# Altium project УШЯИ.467444.130_R1.PrjPcb
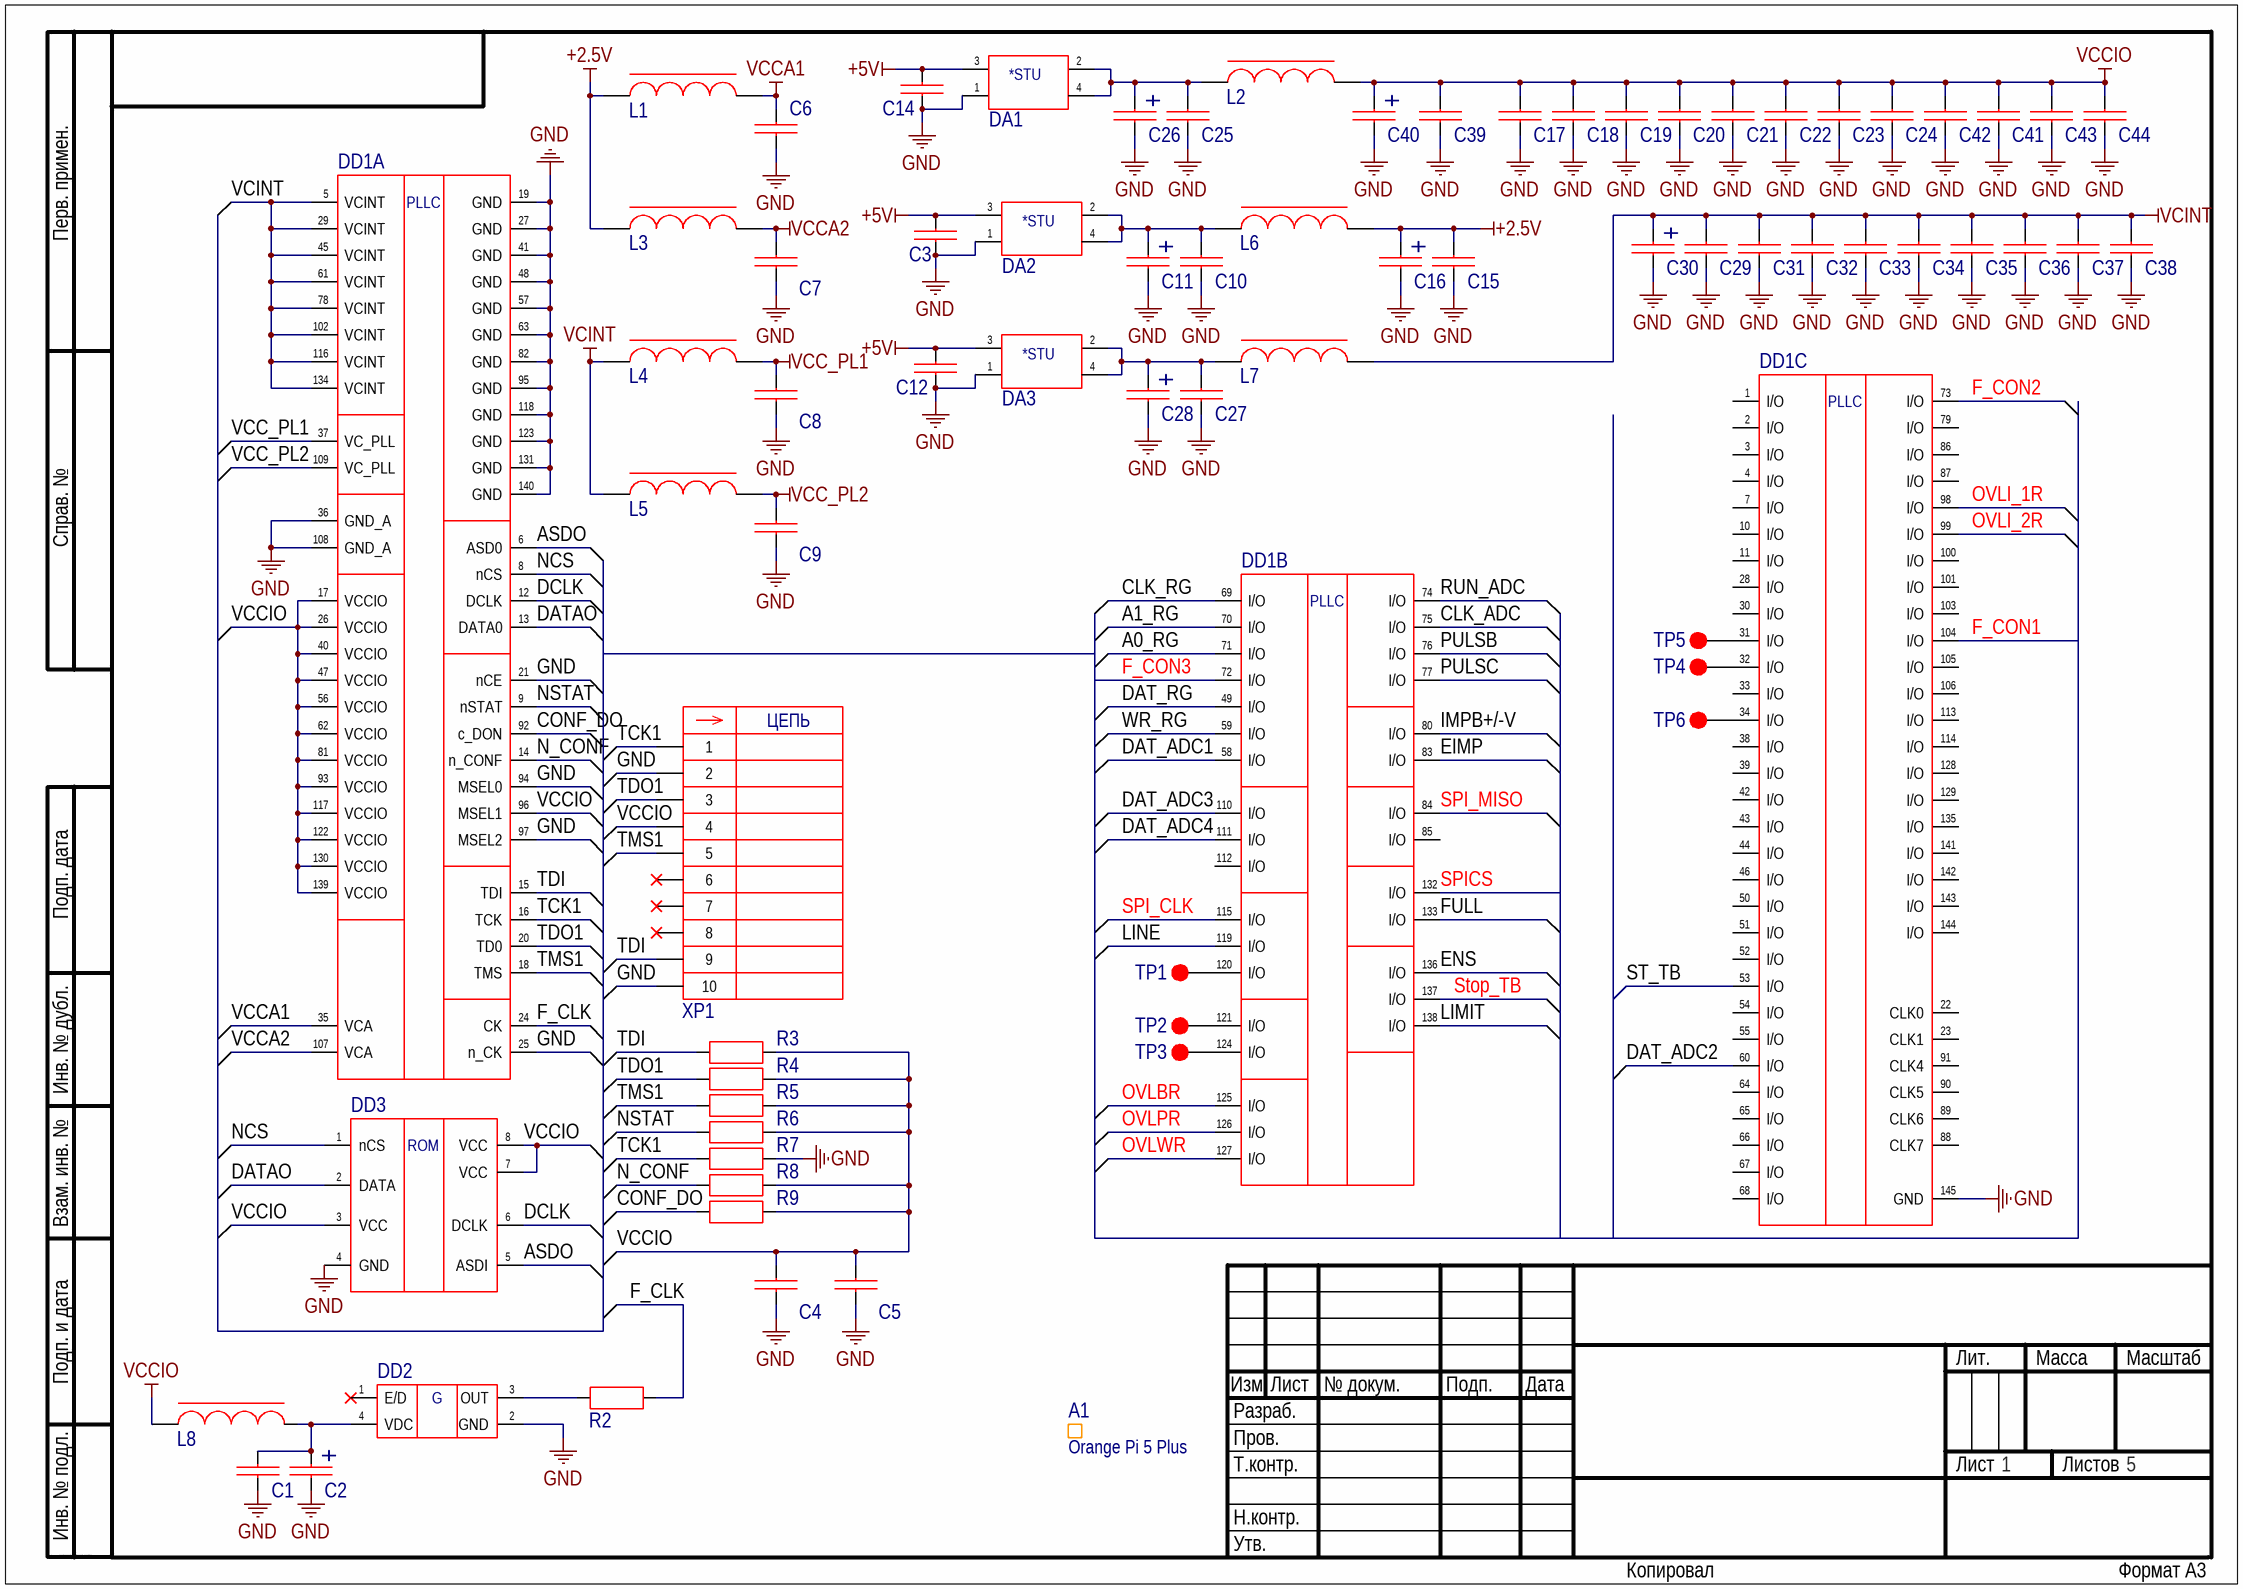
[diagram p0: УШЯИ.467444.130Э3_1-R1.SchDoc]
4 sheets, 195 parts. Net scope: global (net labels, ports and power ports of the same name join across sheets).
Board file: УШЯИ.467444.130_R1.PcbDoc
Sheets:
  УШЯИ.467444.130Э3_1-R1.SchDoc
  УШЯИ.467444.130Э3_2-R1.SchDoc
  УШЯИ.467444.130Э3_4-R1.SchDoc
  УШЯИ.467444.130Э3_5-R1.SchDoc

## Sheet УШЯИ.467444.130Э3_1-R1.SchDoc
size 420 x 297 mm; SheetNumber: 1; SheetTotal: 5

### Parts
A1  Orange Pi 5 Plus  [Orange_Pi_5_Plus]
C1  0,1 µF  [C_0805 [2012 Metric]]  (value not drawn)
C2  4,7 µF  [C+_1210 [3528-21 Metric]]  (value not drawn)
C3  0,1 µF  [C_0805 [2012 Metric]]  (value not drawn)
C4  1 µF  [C_0805 [2012 Metric]]  (value not drawn)
C5  1 µF  [C_0805 [2012 Metric]]  (value not drawn)
C6  0,1 µF  [C_0805 [2012 Metric]]  (value not drawn)
C7  0,1 µF  [C_0805 [2012 Metric]]  (value not drawn)
C8  0,1 µF  [C_0805 [2012 Metric]]  (value not drawn)
C9  0,1 µF  [C_0805 [2012 Metric]]  (value not drawn)
C10  0,1 µF  [C_0805 [2012 Metric]]  (value not drawn)
C11  4,7 µF  [C+_1210 [3528-21 Metric]]  (value not drawn)
C12  0,1 µF  [C_0805 [2012 Metric]]  (value not drawn)
C14  0,1 µF  [C_0805 [2012 Metric]]  (value not drawn)
C15  0,1 µF  [C_0805 [2012 Metric]]  (value not drawn)
C16  10 µF  [C+_1210 [3528-21 Metric]]  (value not drawn)
C17  0,1 µF  [C_0805 [2012 Metric]]  (value not drawn)
C18  0,1 µF  [C_0805 [2012 Metric]]  (value not drawn)
C19  0,1 µF  [C_0805 [2012 Metric]]  (value not drawn)
C20  0,1 µF  [C_0805 [2012 Metric]]  (value not drawn)
C21  0,1 µF  [C_0805 [2012 Metric]]  (value not drawn)
C22  0,1 µF  [C_0805 [2012 Metric]]  (value not drawn)
C23  0,1 µF  [C_0805 [2012 Metric]]  (value not drawn)
C24  0,1 µF  [C_0805 [2012 Metric]]  (value not drawn)
C25  0,1 µF  [C_0805 [2012 Metric]]  (value not drawn)
C26  4,7 µF  [C+_1210 [3528-21 Metric]]  (value not drawn)
C27  0,1 µF  [C_0805 [2012 Metric]]  (value not drawn)
C28  4,7 µF  [C+_1210 [3528-21 Metric]]  (value not drawn)
C29  0,1 µF  [C_0805 [2012 Metric]]  (value not drawn)
C30  4,7 µF  [C+_1210 [3528-21 Metric]]  (value not drawn)
C31  0,1 µF  [C_0805 [2012 Metric]]  (value not drawn)
C32  0,1 µF  [C_0805 [2012 Metric]]  (value not drawn)
C33  0,1 µF  [C_0805 [2012 Metric]]  (value not drawn)
C34  0,1 µF  [C_0805 [2012 Metric]]  (value not drawn)
C35  0,1 µF  [C_0805 [2012 Metric]]  (value not drawn)
C36  0,1 µF  [C_0805 [2012 Metric]]  (value not drawn)
C37  0,1 µF  [C_0805 [2012 Metric]]  (value not drawn)
C38  0,1 µF  [C_0805 [2012 Metric]]  (value not drawn)
C39  0,1 µF  [C_0805 [2012 Metric]]  (value not drawn)
C40  10 µF  [C+_1210 [3528-21 Metric]]  (value not drawn)
C41  0,1 µF  [C_0805 [2012 Metric]]  (value not drawn)
C42  0,1 µF  [C_0805 [2012 Metric]]  (value not drawn)
C43  0,1 µF  [C_0805 [2012 Metric]]  (value not drawn)
C44  0,1 µF  [C_0805 [2012 Metric]]  (value not drawn)
DA1  LD1117AS33TR  [SOT-223]  (value not drawn)
DA2  LD1117AS25TR  [SOT-223]  (value not drawn)
DA3  LD1117AS12TR  [SOT-223]  (value not drawn)
DD1  EP3C5E144I7  [EQFP-144[20x20]_0.5_22x22x1.6]  (value not drawn)  (parts A,B,C of 3)
DD2  O 20,0-JO32-B-3.3-1-T1-LF  [JO32]  (value not drawn)
DD3  EPCS4SI8N  [SOIC-8_1.27_5x4x1.75]  (value not drawn)
L1  0,22 μH  [IND_LQH31CN]  (value not drawn)
L2  (no value)  [IND_0805 [2012 Metric]]
L3  0,22 μH  [IND_LQH31CN]  (value not drawn)
L4  0,22 μH  [IND_LQH31CN]  (value not drawn)
L5  0,22 μH  [IND_LQH31CN]  (value not drawn)
L6  (no value)  [IND_0805 [2012 Metric]]
L7  (no value)  [IND_0805 [2012 Metric]]
L8  (no value)  [IND_0805 [2012 Metric]]
R2  51R  [R_0805 [2012 Metric]]  (value not drawn)
R3  1k  [R_0805 [2012 Metric]]  (value not drawn)
R4  10k  [R_0805 [2012 Metric]]  (value not drawn)
R5  1k  [R_0805 [2012 Metric]]  (value not drawn)
R6  10k  [R_0805 [2012 Metric]]  (value not drawn)
R7  1k  [R_0805 [2012 Metric]]  (value not drawn)
R8  10k  [R_0805 [2012 Metric]]  (value not drawn)
R9  10k  [R_0805 [2012 Metric]]  (value not drawn)
TP1  (no value)  [DSP_1.3]  (no BOM)
TP2  (no value)  [DSP_1.3]  (no BOM)
TP3  (no value)  [DSP_1.3]  (no BOM)
TP4  (no value)  [DSP_1.3]  (no BOM)
TP5  (no value)  [DSP_1.3]  (no BOM)
TP6  (no value)  [DSP_1.3]  (no BOM)
XP1  PLD-10  [PLD-10]  (value not drawn)

### Nets
+2.5V: C15.2 C16.+ L1.1 L3.1 L6.2
+5V: C3.2 C12.2 C14.2 DA1.3(VIN) DA2.3(VIN) DA3.3(VIN)
GND: C1.1 C2.- C3.1 C4.1 C5.1 C6.1 C7.1 C8.1 C9.1 C10.1 C11.- C12.1 C14.1 C15.1 C16.- C17.1 C18.1 C19.1 C20.1 C21.1 C22.1 C23.1 C24.1 C25.1 C26.- C27.1 C28.- C29.1 C30.- C31.1 C32.1 C33.1 C34.1 C35.1 C36.1 C37.1 C38.1 C39.1 C40.- C41.1 C42.1 C43.1 C44.1 DA1.1(ADJ/GND) DA2.1(ADJ/GND) DA3.1(ADJ/GND) DD1.19(GND) DD1.21(nCE) DD1.25(n_CK) DD1.27(GND) DD1.36(GND_A) DD1.41(GND) DD1.48(GND) DD1.57(GND) DD1.63(GND) DD1.82(GND) DD1.94(MSEL0) DD1.95(GND) DD1.97(MSEL2) DD1.108(GND_A) DD1.118(GND) DD1.123(GND) DD1.131(GND) DD1.140(GND) DD1.145(GND) DD2.2(GND) DD3.4(GND) R7.2 XP1.2 XP1.10
VCC_PL1: C8.2 DD1.37(VC_PLL) L4.2
VCC_PL2: C9.2 DD1.109(VC_PLL) L5.2
VCCA1: C6.2 DD1.35(VCA) L1.2
VCCA2: C7.2 DD1.107(VCA) L3.2
VCCIO: C4.2 C5.2 C17.2 C18.2 C19.2 C20.2 C21.2 C22.2 C23.2 C24.2 C39.2 C40.+ C41.2 C42.2 C43.2 C44.2 DD1.17(VCCIO) DD1.26(VCCIO) DD1.40(VCCIO) DD1.47(VCCIO) DD1.56(VCCIO) DD1.62(VCCIO) DD1.81(VCCIO) DD1.93(VCCIO) DD1.96(MSEL1) DD1.117(VCCIO) DD1.122(VCCIO) DD1.130(VCCIO) DD1.139(VCCIO) DD3.3(VCC) DD3.7(VCC) DD3.8(VCC) L2.2 L8.1 R3.2 R4.2 R5.2 R6.2 R8.2 R9.2 XP1.4
VCINT: C29.2 C30.+ C31.2 C32.2 C33.2 C34.2 C35.2 C36.2 C37.2 C38.2 DD1.5(VCINT) DD1.29(VCINT) DD1.45(VCINT) DD1.61(VCINT) DD1.78(VCINT) DD1.102(VCINT) DD1.116(VCINT) DD1.134(VCINT) L4.1 L5.1 L7.2
A0_RG: DD1.71(I/O)
A1_RG: DD1.70(I/O)
ASDO: DD1.6(ASD0) DD3.5(ASDI)
CLK_ADC: DD1.75(I/O)
CLK_RG: DD1.69(I/O)
CONF_DO: DD1.92(c_DON) R9.1
DAT_ADC1: DD1.58(I/O)
DAT_ADC2: DD1.60(I/O)
DAT_ADC3: DD1.110(I/O)
DAT_ADC4: DD1.111(I/O)
DAT_RG: DD1.49(I/O)
DATAO: DD1.13(DATA0) DD3.2(DATA)
DCLK: DD1.12(DCLK) DD3.6(DCLK)
EIMP: DD1.83(I/O)
ENS: DD1.136(I/O)
F_CLK: DD1.24(CK) R2.2
F_CON1: DD1.104(I/O)
F_CON2: DD1.73(I/O)
F_CON3: DD1.72(I/O)
FULL: DD1.133(I/O)
IMPB+/-V: DD1.80(I/O)
LIMIT: DD1.138(I/O)
LINE: DD1.119(I/O)
N_CONF: DD1.14(n_CONF) R8.1
NCS: DD1.8(nCS) DD3.1(nCS)
NSTAT: DD1.9(nSTAT) R6.1
OVLBR: DD1.125(I/O)
OVLI_1R: DD1.98(I/O)
OVLI_2R: DD1.99(I/O)
OVLPR: DD1.126(I/O)
OVLWR: DD1.127(I/O)
PULSB: DD1.76(I/O)
PULSC: DD1.77(I/O)
RUN_ADC: DD1.74(I/O)
SPI_CLK: DD1.115(I/O)
SPI_MISO: DD1.84(I/O)
SPICS: DD1.132(I/O)
ST_TB: DD1.53(I/O)
Stop_TB: DD1.137(I/O)
TCK1: DD1.16(TCK) R7.1 XP1.1
TDI: DD1.15(TDI) R3.1 XP1.9
TDO1: DD1.20(TD0) R4.1 XP1.3
TMS1: DD1.18(TMS) R5.1 XP1.5
WR_RG: DD1.59(I/O)
NetC1_2: C1.2 C2.+ DD2.4(VDC) L8.2
NetC10_2: C10.2 C11.+ DA2.2(VOUT) DA2.4(VOUT) L6.1
NetC25_2: C25.2 C26.+ DA1.2(VOUT) DA1.4(VOUT) L2.1
NetC27_2: C27.2 C28.+ DA3.2(VOUT) DA3.4(VOUT) L7.1
NetDD1_31: DD1.31(I/O) TP5.1
NetDD1_32: DD1.32(I/O) TP4.1
NetDD1_34: DD1.34(I/O) TP6.1
NetDD1_120: DD1.120(I/O) TP1.1
NetDD1_121: DD1.121(I/O) TP2.1
NetDD1_124: DD1.124(I/O) TP3.1
NetDD2_3: DD2.3(OUT) R2.1

Not connected (* = marked no-connect by the designer): DD1 1(I/O) 2(I/O) 3(I/O) 4(I/O) 7(I/O) 10(I/O) 11(I/O) 22(CLK0) 23(CLK1) 28(I/O) 30(I/O) 33(I/O) 38(I/O) 39(I/O) 42(I/O) 43(I/O) 44(I/O) 46(I/O) 50(I/O) 51(I/O) 52(I/O) 54(I/O) 55(I/O) 64(I/O) 65(I/O) 66(I/O) 67(I/O) 68(I/O) 79(I/O) 85(I/O) 86(I/O) 87(I/O) 88(CLK7) 89(CLK6) 90(CLK5) 91(CLK4) 100(I/O) 101(I/O) 103(I/O) 105(I/O) 106(I/O) 112(I/O) 113(I/O) 114(I/O) 128(I/O) 129(I/O) 135(I/O) 141(I/O) 142(I/O) 143(I/O) 144(I/O); DD2 1(E/D)*; XP1 6* 7* 8*

### Notes on the sheet
- Перв. примен.
- Справ. №
- Подп. дата
- Инв. № дубл.
- Взам. инв. №
- Подп. и дата
- Изм.
- Разраб.
- Лист
- № докум.
- Подп.
- Дата
- Лит.
- Масса
- Масштаб
- Пров.
- Т.контр.
- Листов
- Инв. № подл.
- Н.контр.
- Утв.
- ALTIUM GOSTBOM2.0 KEV
- Копировал
- Формат А3
- (in symbol Conn_7) ЦЕПЬ
- (in symbol IC_1) *STU
- (in symbol IC_8) *STU
- (in symbol IC_9) *STU
- (in symbol IC_12) ROM
- (in symbol IC_13, part A) PLLC
- (in symbol IC_13, part B) PLLC
- (in symbol IC_13, part C) PLLC
- (in symbol Other_16) G

### Library data of the parts
A1 = Other_15: 8GB Rockchip RK3588, HDMI 2.1, Gigabit LAN port, USB2.0/3.0, microSD card slot, USB Type-C; Component Name: Одноплатный компьютер Orange Pi 5 Plus 8GB; Other information: Идет с покупным устройством: твердотельный накопитель Kingspec SSD NE-128 2280; Крепёж: Винт В2.М3-6gx8.36.016 ГОСТ 17473-80 (4шт.), гайка М3-7Н.04.016 ГОСТ 5927-70 (4шт.), Шайба 3.65Г.016 ГОСТ 6402-70 (8шт.),  Шайба 3.04.013 ГОСТ 11371-78 (8шт.), Стойка PCHSN-10 (Ni) Connfly electronic (ChipDip 9000221060)(4шт.); ID: Other_15; Manufacturer: Orange Pi; Height: 29mm; Weight, kg: 0,115; Device: Orange Pi 5 Plus
C1 C3 C6-C10 C12 C14 C15 C17-C25 C27 C29 C31-C39 C41-C44 = Cap_60: Неполярный конденсатор; Manufacturer: Murata; ID: Cap_60; Component Name: Конденсатор GRM21BR71H104KA01L; Voltage: 50V; Tolerance: ±10%; Datasheet: https://www.murata.com/en-eu/products/productdetail?partno=GRM21BR71H104KA01%23; Capacitance: 0,1 µF; Case / Package: 0805 [2012 Metric]; Height: 1.4mm; Weight, kg: 0,000006
  C27 C29: ClassName: Class_VCINT
  C39: ClassName: Class_VCCIO
C2 C11 C26 C28 C30 = Cap_14: Полярный конденсатор; Manufacturer: KYOCERA AVX; ID: Cap_14; Component Name: Конденсатор TAJB475K020; Voltage: 20V / 10V; Tolerance: ±10%; Datasheet: https://datasheets.kyocera-avx.com/TAJ.pdf; Capacitance: 4,7 µF; Case / Package: 1210 [3528-21 Metric]; Height: 2mm; Weight, kg: 0,000016
  C11: ClassName: Class_+2.5V
  C26: ClassName: Class_VCCIO
  C28 C30: ClassName: Class_VCINT
C4 C5 = Cap_96: Неполярный конденсатор; Manufacturer: Murata; ID: Cap_96; Component Name: Конденсатор GRM21BR71H105KA01L; Voltage: 16V; Tolerance: ±10%; Catalogue: CHIPDIP 8046406206; Datasheet: https://static.chipdip.ru/lib/223/DOC011223313.pdf; Capacitance: 1 µF; Case / Package: 0805 [2012 Metric]; Height: 1.4mm; Weight, kg: 0,000006
C16 C40 = Cap_56: Полярный конденсатор; Manufacturer: KYOCERA AVX; ID: Cap_56; Component Name: Конденсатор TAJB106M020; Voltage: 20V / 10V; Tolerance: ±20%; Datasheet: https://datasheets.kyocera-avx.com/TAJ.pdf; Capacitance: 10 µF; Case / Package: 1210 [3528-21 Metric]; Height: 2mm; Weight, kg: 0,000016
  C16: ClassName: Class_+2.5V
  C40: ClassName: Class_VCCIO
DA1 = IC_1: IC, Fixed LDO Voltage Regulator, 5.3V to 10V, 1.15V Dropout, 3.3Vout, 1Aout; Manufacturer: STMicroelectronics; ID: IC_1; Component Name: Микросхема LD1117AS33TR; Catalogue: DIGI-KEY 497-1228-2-ND; Device: LD1117AS33TR; Datasheet: https://www.st.com/content/ccc/resource/technical/document/datasheet/a5/c3/3f/c9/2b/15/40/49/CD00002116.pdf/files/CD00002116.pdf/jcr:content/translations/en.CD00002116.pdf; Case / Package: SOT-223; Height: 1.9mm; Weight, kg: 0,0045; ClassName: Class_VCCIO
DA2 = IC_8: IC, Linear Voltage Regulator, 1 Output, 1V Dropout, 2.5Vout, 1Aout; Manufacturer: STMicroelectronics; ID: IC_8; Component Name: Микросхема LD1117AS25TR; Catalogue: DIGI-KEY 497-1227-1-ND; Device: LD1117AS25TR; Datasheet: https://www.st.com/content/ccc/resource/technical/document/datasheet/a5/c3/3f/c9/2b/15/40/49/CD00002116.pdf/files/CD00002116.pdf/jcr:content/translations/en.CD00002116.pdf; Case / Package: SOT-223; Height: 1.9mm; Weight, kg: 0,0045; ClassName: Class_+2.5V
DA3 = IC_9: IC, Fixed LDO Voltage Regulator, 1 Output, 1V Dropout, 1.2Vout, 1Aout; Manufacturer: STMicroelectronics; ID: IC_9; Component Name: Микросхема LD1117AS12TR; Catalogue: DIGI-KEY 497-6445-1-ND; Device: LD1117AS12TR; Datasheet: https://www.st.com/content/ccc/resource/technical/document/datasheet/a5/c3/3f/c9/2b/15/40/49/CD00002116.pdf/files/CD00002116.pdf/jcr:content/translations/en.CD00002116.pdf; Case / Package: SOT-223; Height: 1.9mm; Weight, kg: 0,0045; ClassName: Class_VCINT
DD1 = IC_13: IC, Cyclone III, Field Programmable Gate Array (FPGA), 	1.15V to 1.25V, 315 MHz, 94 I/O; Manufacturer: Intel; ID: IC_13; Component Name: Микросхема EP3C5E144I7; Catalogue: DIGI-KEY EP3C5E144I7-ND; Device: EP3C5E144I7; Datasheet: https://www.intel.com/content/dam/support/us/en/programmable/support-resources/bulk-container/pdfs/literature/hb/cfg/cyc-c51014.pdf; Case / Package: 144-EQFP (20x20); Height: 1.6mm; Weight, kg: 0,012
DD2 = Other_16: Crystals, Oscillators, 20 MHz; Manufacturer: Jauch Quartz GmbH; Component Name: Кварцевый генератор O 20,0-JO32-B-3.3-1-T1-LF; ID: Other_16; Datasheet: https://static.chipdip.ru/lib/464/DOC049464856.pdf; Height: 1.15mm; Weight, kg: 0,001; Device: O 20,0-JO32-B-3.3-1-T1-LF
DD3 = IC_12: IC, FPGA Configuration Memory, Flash, 4 Mbit, 40 MHz, JTAG, Serial; Manufacturer: Intel; ID: IC_12; Component Name: Микросхема EPCS4SI8N; Catalogue: FARNELL 1662262; Device: EPCS4SI8N; Datasheet: https://www.intel.com/content/dam/support/us/en/programmable/support-resources/bulk-container/pdfs/literature/hb/cfg/cyc-c51014.pdf; Case / Package: SOIC-8; Height: 1.75mm; Weight, kg: 0,0002
L1 L3-L5 = Ind_4: Manufacturer: Murata; ID: Ind_4; Component Name: Дроссель LQH31CNR22M03; Isat: 850mA; Resistance: 0.1 ohm; Tolerance: ±20%; Datasheet: https://www.murata.com/products/productdetail?partno=LQH31CNR22M03%23; Inductance: 0,22 μH; Height: 2mm; Weight, kg: 0,00003
L2 L6-L8 = Ind_5: Manufacturer: Vishay; ID: Ind_5; Component Name: Фильтр ферритовый ILBB0805ER601V; Isat: 200mA; Resistance: 300 mOhm; Tolerance: ±25%; Catalogue: DIGI-KEY 541-2297-1-ND; Datasheet: https://www.vishay.com/docs/34025/ilbb0805.pdf; Case / Package: 0805 [2012 Metric]; Height: 1.1mm; Weight, kg: 0,00006
  L2: ClassName: Class_VCCIO
  L6: ClassName: Class_+2.5V
  L7: ClassName: Class_VCINT
R2 = Res_12: ID: Res_12; Component Name: Резистор 0805-51 Ом ±5%; Tolerance: ±5%; Resistance: 51R; Case / Package: 0805 [2012 Metric]; Height: 0.7mm; Weight, kg: 0,000006
R3 R5 R7 = Res_11: ID: Res_11; Component Name: Резистор 0805-1 кОм ±5%; Tolerance: ±5%; Resistance: 1k; Case / Package: 0805 [2012 Metric]; Height: 0.7mm; Weight, kg: 0,000006
R4 R6 R8 R9 = Res_5: ID: Res_5; Component Name: Резистор 0805-10 кОм ±5%; Tolerance: ±5%; Resistance: 10k; Case / Package: 0805 [2012 Metric]; Height: 0.7mm; Weight, kg: 0,000006
TP1-TP6 = Pad_13: ID: Pad_13; Component Name: TP_DSP_1.3
XP1 = Conn_7: Male, 10 pins, 2 rows, Vertical; Manufacturer: Connfly electronic; ID: Conn_7; Component Name: Вилка PLD-10; Крепёж: Не нужно; Device: PLD-10; Datasheet: https://static.chipdip.ru/lib/977/DOC005977245.pdf; Height: 10.8mm; Weight, kg: 0,00052

## Sheet УШЯИ.467444.130Э3_2-R1.SchDoc
size 420 x 297 mm; SheetNumber: 2; SheetTotal: 5
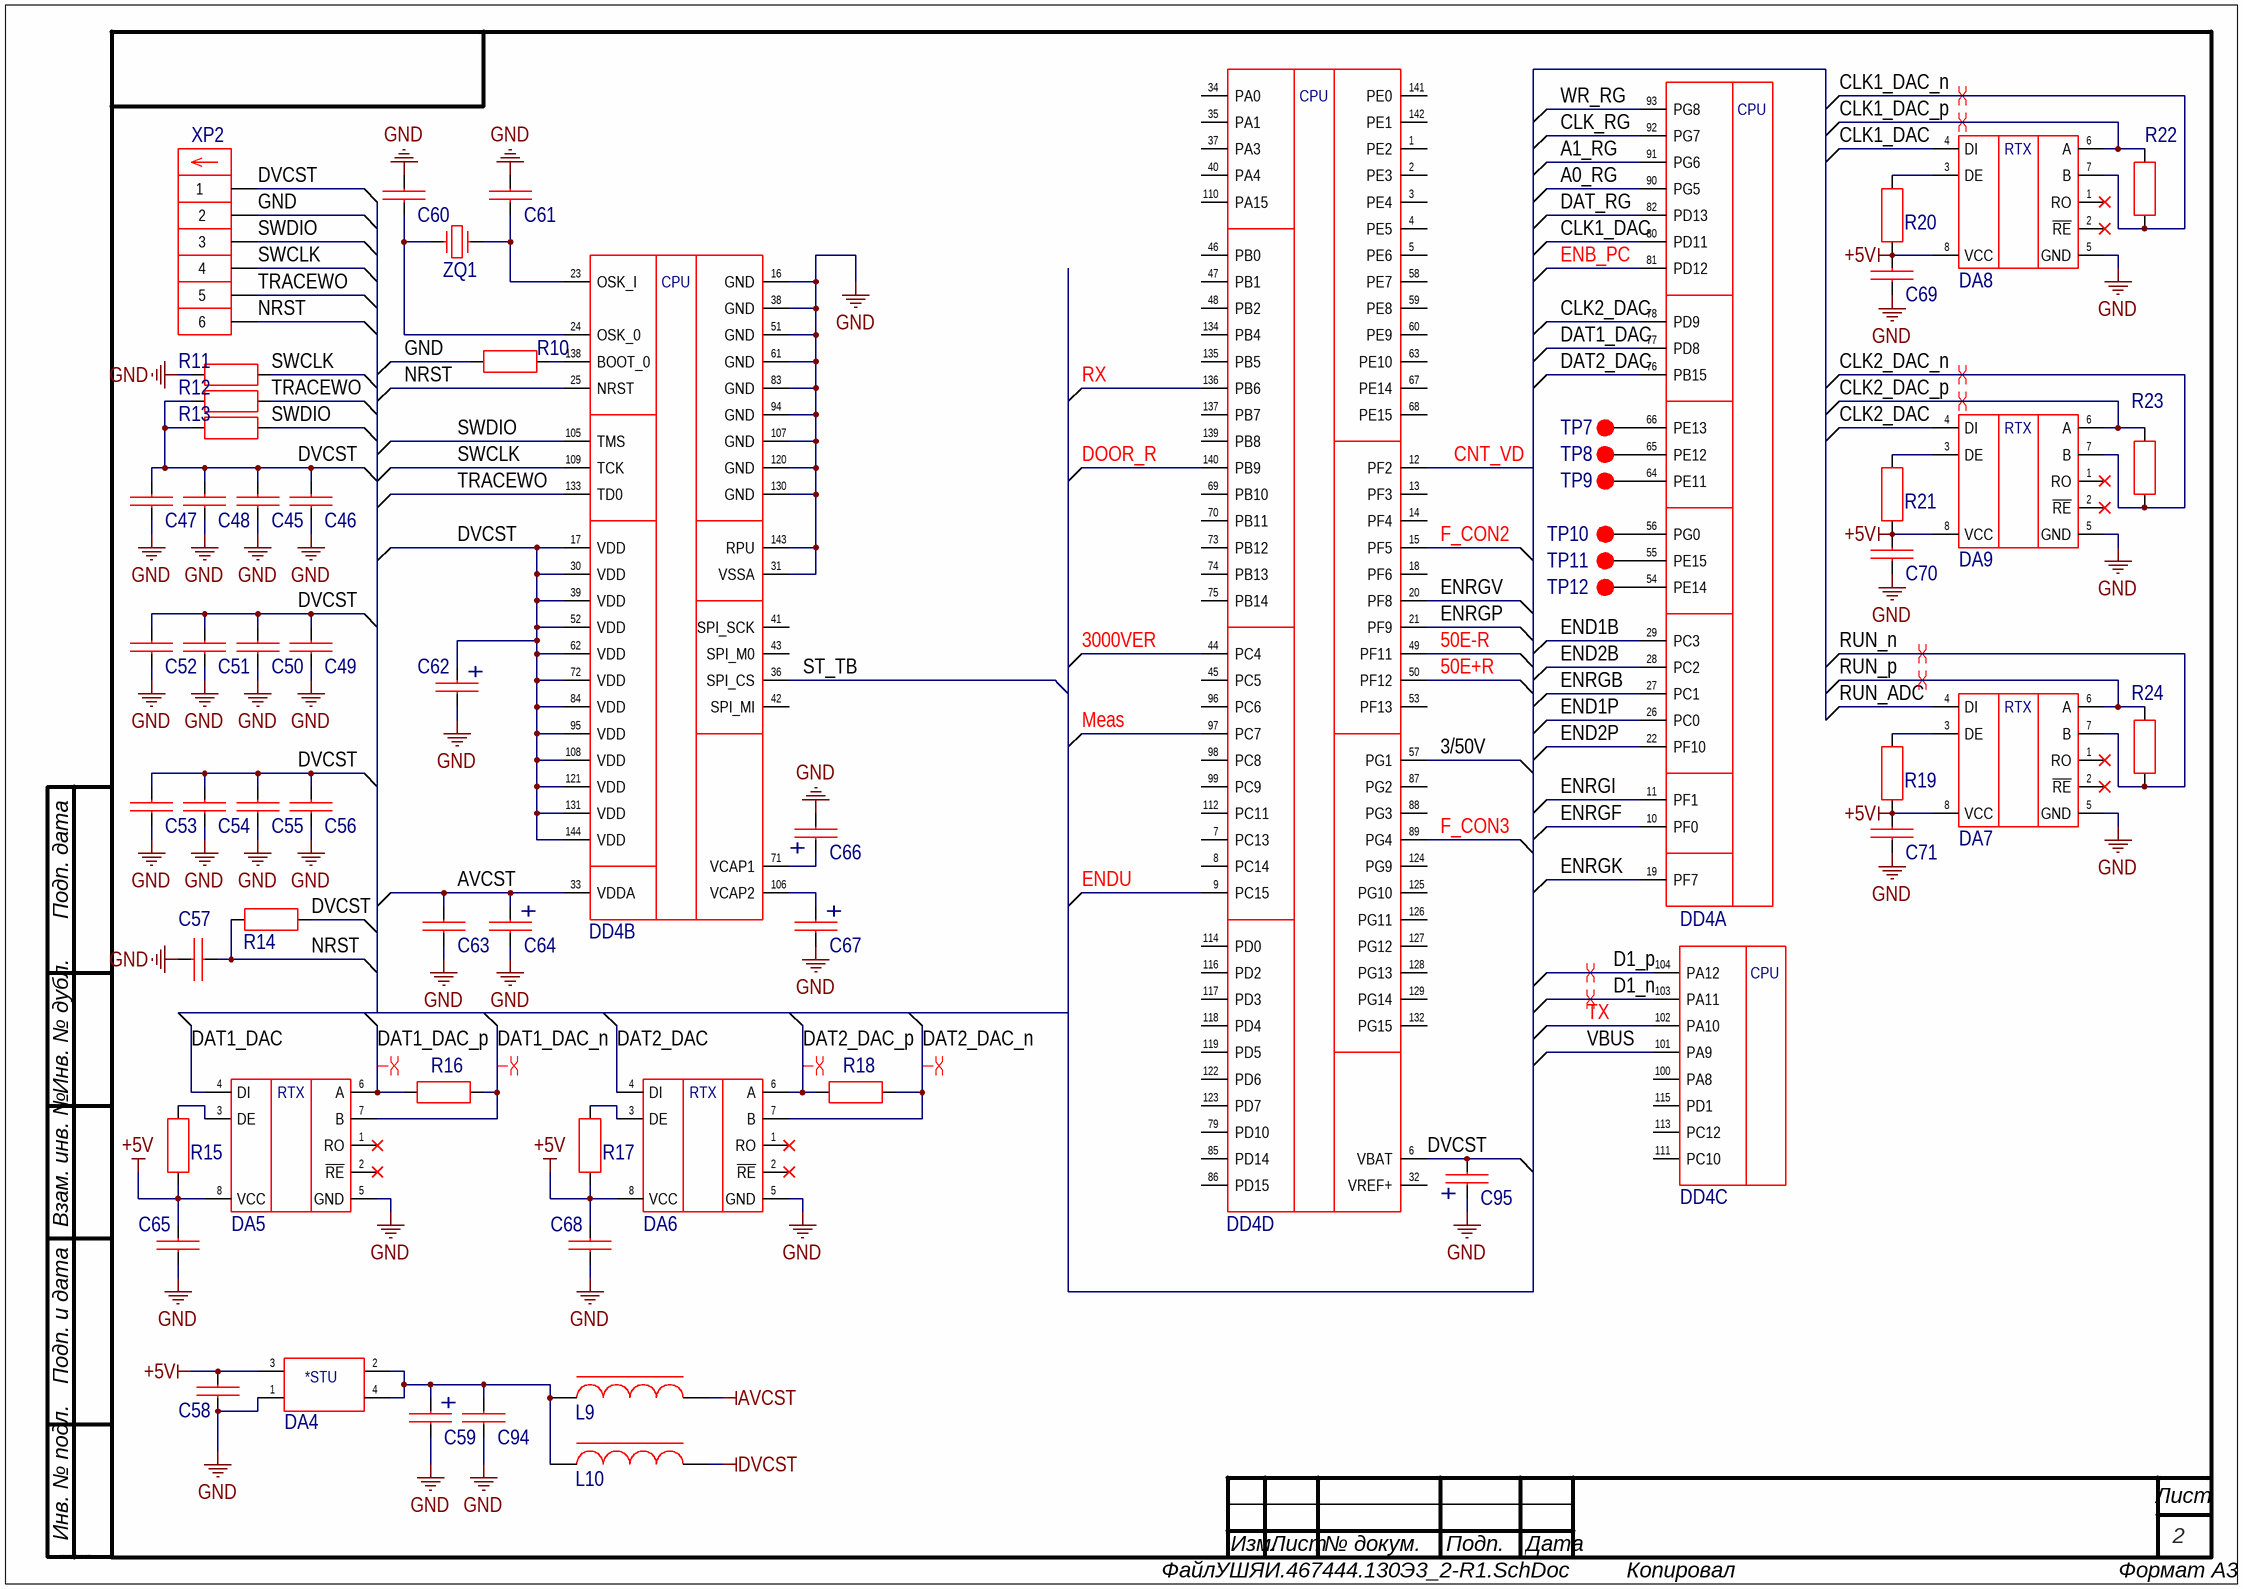
[diagram p1: УШЯИ.467444.130Э3_2-R1.SchDoc]

### Parts
C45  0,1 µF  [C_0805 [2012 Metric]]  (value not drawn)
C46  0,1 µF  [C_0805 [2012 Metric]]  (value not drawn)
C47  0,1 µF  [C_0805 [2012 Metric]]  (value not drawn)
C48  0,1 µF  [C_0805 [2012 Metric]]  (value not drawn)
C49  0,1 µF  [C_0805 [2012 Metric]]  (value not drawn)
C50  0,1 µF  [C_0805 [2012 Metric]]  (value not drawn)
C51  0,1 µF  [C_0805 [2012 Metric]]  (value not drawn)
C52  0,1 µF  [C_0805 [2012 Metric]]  (value not drawn)
C53  0,1 µF  [C_0805 [2012 Metric]]  (value not drawn)
C54  0,1 µF  [C_0805 [2012 Metric]]  (value not drawn)
C55  0,1 µF  [C_0805 [2012 Metric]]  (value not drawn)
C56  0,1 µF  [C_0805 [2012 Metric]]  (value not drawn)
C57  0,1 µF  [C_0805 [2012 Metric]]  (value not drawn)
C58  0,1 µF  [C_0805 [2012 Metric]]  (value not drawn)
C59  4,7 µF  [C+_1210 [3528-21 Metric]]  (value not drawn)
C60  20 pF  [C_0805 [2012 Metric]]  (value not drawn)
C61  20 pF  [C_0805 [2012 Metric]]  (value not drawn)
C62  10 µF  [C+_1210 [3528-21 Metric]]  (value not drawn)
C63  0,1 µF  [C_0805 [2012 Metric]]  (value not drawn)
C64  10 µF  [C+_1210 [3528-21 Metric]]  (value not drawn)
C65  0,1 µF  [C_0805 [2012 Metric]]  (value not drawn)
C66  2,2 µF  [C+_1206 [3216-18 Metric]]  (value not drawn)
C67  2,2 µF  [C+_1206 [3216-18 Metric]]  (value not drawn)
C68  0,1 µF  [C_0805 [2012 Metric]]  (value not drawn)
C69  0,1 µF  [C_0805 [2012 Metric]]  (value not drawn)
C70  0,1 µF  [C_0805 [2012 Metric]]  (value not drawn)
C71  0,1 µF  [C_0805 [2012 Metric]]  (value not drawn)
C94  0,1 µF  [C_0805 [2012 Metric]]  (value not drawn)
C95  10 µF  [C+_1210 [3528-21 Metric]]  (value not drawn)
DA4  LD1117AS33TR  [SOT-223]  (value not drawn)
DA5  ADM483AR  [SOIC-8_1.27_5x4x1.75]  (value not drawn)
DA6  ADM483AR  [SOIC-8_1.27_5x4x1.75]  (value not drawn)
DA7  ADM483AR  [SOIC-8_1.27_5x4x1.75]  (value not drawn)
DA8  ADM483AR  [SOIC-8_1.27_5x4x1.75]  (value not drawn)
DA9  ADM483AR  [SOIC-8_1.27_5x4x1.75]  (value not drawn)
DD4  STM32F429VIT6STM32F407ZGTx  [QFP-144[20x20]_0.5_22x22x1.6]  (value not drawn)  (parts A,B,C,D of 4)
L9  (no value)  [IND_0805 [2012 Metric]]
L10  (no value)  [IND_0805 [2012 Metric]]
R10  10k  [R_0805 [2012 Metric]]  (value not drawn)
R11  10k  [R_0805 [2012 Metric]]  (value not drawn)
R12  10k  [R_0805 [2012 Metric]]  (value not drawn)
R13  10k  [R_0805 [2012 Metric]]  (value not drawn)
R14  10k  [R_0805 [2012 Metric]]  (value not drawn)
R15  10k  [R_0805 [2012 Metric]]  (value not drawn)
R16  100R  [R_0805 [2012 Metric]]  (value not drawn)
R17  10k  [R_0805 [2012 Metric]]  (value not drawn)
R18  100R  [R_0805 [2012 Metric]]  (value not drawn)
R19  10k  [R_0805 [2012 Metric]]  (value not drawn)
R20  10k  [R_0805 [2012 Metric]]  (value not drawn)
R21  10k  [R_0805 [2012 Metric]]  (value not drawn)
R22  100R  [R_0805 [2012 Metric]]  (value not drawn)
R23  100R  [R_0805 [2012 Metric]]  (value not drawn)
R24  100R  [R_0805 [2012 Metric]]  (value not drawn)
TP7  (no value)  [DSP_1.3]  (no BOM)
TP8  (no value)  [DSP_1.3]  (no BOM)
TP9  (no value)  [DSP_1.3]  (no BOM)
TP10  (no value)  [DSP_1.3]  (no BOM)
TP11  (no value)  [DSP_1.3]  (no BOM)
TP12  (no value)  [DSP_1.3]  (no BOM)
XP2  AMPMODU II 280372-2  [AMP II-280372-2]  (value not drawn)
ZQ1  Q 25.0JXS63-12-30/30-FU  [JXS63]  (value not drawn)

### Nets
+5V: C58.1 C65.2 C68.2 C69.2 C70.2 C71.2 DA4.3(VIN) DA5.8(VCC) DA6.8(VCC) DA7.8(VCC) DA8.8(VCC) DA9.8(VCC) R15.1 R17.1 R19.1 R20.1 R21.1
AVCST: C63.2 C64.+ DD4.33(VDDA) L9.2
DVCST: C45.2 C46.2 C47.2 C48.2 C49.2 C50.2 C51.2 C52.2 C53.2 C54.2 C55.2 C56.2 C62.+ C95.- DD4.6(VBAT) DD4.17(VDD) DD4.30(VDD) DD4.39(VDD) DD4.52(VDD) DD4.62(VDD) DD4.72(VDD) DD4.84(VDD) DD4.95(VDD) DD4.108(VDD) DD4.121(VDD) DD4.131(VDD) DD4.144(VDD) L10.2 R12.1 R13.1 R14.1 XP2.1
GND: C45.1 C46.1 C47.1 C48.1 C49.1 C50.1 C51.1 C52.1 C53.1 C54.1 C55.1 C56.1 C57.1 C58.2 C59.- C60.2 C61.2 C62.- C63.1 C64.- C65.1 C66.- C67.- C68.1 C69.1 C70.1 C71.1 C94.1 C95.+ DA4.1(ADJ/GND) DA5.5(GND) DA6.5(GND) DA7.5(GND) DA8.5(GND) DA9.5(GND) DD4.16(GND) DD4.31(VSSA) DD4.38(GND) DD4.51(GND) DD4.61(GND) DD4.83(GND) DD4.94(GND) DD4.107(GND) DD4.120(GND) DD4.130(GND) DD4.143(RPU) R10.1 R11.1 XP2.2
3/50V: DD4.57(PG1)
50E+R: DD4.50(PF12)
50E-R: DD4.49(PF11)
3000VER: DD4.44(PC4)
A0_RG: DD4.90(PG5)
A1_RG: DD4.91(PG6)
CLK1_DAC: DA8.4(DI) DD4.80(PD11)
CLK1_DAC_n: DA8.7(B) R22.1
CLK1_DAC_p: DA8.6(A) R22.2
CLK2_DAC: DA9.4(DI) DD4.78(PD9)
CLK2_DAC_n: DA9.7(B) R23.1
CLK2_DAC_p: DA9.6(A) R23.2
CLK_RG: DD4.92(PG7)
CNT_VD: DD4.12(PF2)
D1_n: DD4.103(PA11)
D1_p: DD4.104(PA12)
DAT1_DAC: DA5.4(DI) DD4.77(PD8)
DAT1_DAC_n: DA5.7(B) R16.2
DAT1_DAC_p: DA5.6(A) R16.1
DAT2_DAC: DA6.4(DI) DD4.76(PB15)
DAT2_DAC_n: DA6.7(B) R18.2
DAT2_DAC_p: DA6.6(A) R18.1
DAT_RG: DD4.82(PD13)
DOOR_R: DD4.140(PB9)
ENB_PC: DD4.81(PD12)
END1B: DD4.29(PC3)
END1P: DD4.26(PC0)
END2B: DD4.28(PC2)
END2P: DD4.22(PF10)
ENDU: DD4.9(PC15)
ENRGB: DD4.27(PC1)
ENRGF: DD4.10(PF0)
ENRGI: DD4.11(PF1)
ENRGK: DD4.19(PF7)
ENRGP: DD4.21(PF9)
ENRGV: DD4.20(PF8)
F_CON2: DD4.15(PF5)
F_CON3: DD4.89(PG4)
Meas: DD4.97(PC7)
NRST: C57.2 DD4.25(NRST) R14.2 XP2.6
RUN_ADC: DA7.4(DI)
RUN_n: DA7.7(B) R24.1
RUN_p: DA7.6(A) R24.2
RX: DD4.136(PB6)
ST_TB: DD4.36(SPI_CS)
SWCLK: DD4.109(TCK) R11.2 XP2.4
SWDIO: DD4.105(TMS) R13.2 XP2.3
TRACEWO: DD4.133(TD0) R12.2 XP2.5
TX: DD4.102(PA10)
VBUS: DD4.101(PA9)
WR_RG: DD4.93(PG8)
NetC59_+: C59.+ C94.2 DA4.2(VOUT) DA4.4(VOUT) L9.1 L10.1
NetC60_1: C60.1 DD4.24(OSK_0) ZQ1.1
NetC61_1: C61.1 DD4.23(OSK_I) ZQ1.3
NetC66_+: C66.+ DD4.71(VCAP1)
NetC67_+: C67.+ DD4.106(VCAP2)
NetDA5_3: DA5.3(DE) R15.2
NetDA6_3: DA6.3(DE) R17.2
NetDA7_3: DA7.3(DE) R19.2
NetDA8_3: DA8.3(DE) R20.2
NetDA9_3: DA9.3(DE) R21.2
NetDD4_54: DD4.54(PE14) TP12.1
NetDD4_55: DD4.55(PE15) TP11.1
NetDD4_56: DD4.56(PG0) TP10.1
NetDD4_64: DD4.64(PE11) TP9.1
NetDD4_65: DD4.65(PE12) TP8.1
NetDD4_66: DD4.66(PE13) TP7.1
NetDD4_138: DD4.138(BOOT_0) R10.2

Not connected (* = marked no-connect by the designer): DA5 1(RO)* 2(~{RE})*; DA6 1(RO)* 2(~{RE})*; DA7 1(RO)* 2(~{RE})*; DA8 1(RO)* 2(~{RE})*; DA9 1(RO)* 2(~{RE})*; DD4 1(PE2) 2(PE3) 3(PE4) 4(PE5) 5(PE6) 7(PC13) 8(PC14) 13(PF3) 14(PF4) 18(PF6) 32(VREF+) 34(PA0) 35(PA1) 37(PA3) 40(PA4) 41(SPI_SCK) 42(SPI_MI) 43(SPI_M0) 45(PC5) 46(PB0) 47(PB1) 48(PB2) 53(PF13) 58(PE7) 59(PE8) 60(PE9) 63(PE10) 67(PE14) 68(PE15) 69(PB10) 70(PB11) 73(PB12) 74(PB13) 75(PB14) 79(PD10) 85(PD14) 86(PD15) 87(PG2) 88(PG3) 96(PC6) 98(PC8) 99(PC9) 100(PA8) 110(PA15) 111(PC10) 112(PC11) 113(PC12) 114(PD0) 115(PD1) 116(PD2) 117(PD3) 118(PD4) 119(PD5) 122(PD6) 123(PD7) 124(PG9) 125(PG10) 126(PG11) 127(PG12) 128(PG13) 129(PG14) 132(PG15) 134(PB4) 135(PB5) 137(PB7) 139(PB8) 141(PE0) 142(PE1)

### Layout directives
differential pair: CLK1_DAC_n, CLK1_DAC_p, CLK2_DAC_n, CLK2_DAC_p, D1_n, D1_p, DAT1_DAC_n, DAT1_DAC_p, DAT2_DAC_n, DAT2_DAC_p, RUN_n, RUN_p

### Notes on the sheet
- Подп. дата
- Инв. № дубл.
- Взам. инв. №
- Подп. и дата
- Инв. № подл.
- Изм.
- Лист
- № докум.
- Подп.
- Дата
- ALTIUM GOSTBOM2.0 KEV
- Файл:
- Копировал
- Формат А3
- (in symbol IC_1) *STU
- (in symbol IC_11) RTX
- (in symbol IC_15, part A) CPU
- (in symbol IC_15, part B) CPU
- (in symbol IC_15, part C) CPU
- (in symbol IC_15, part D) CPU

### Library data of the parts
C45-C58 C63 C65 C68-C71 C94 = Cap_60: as C1 on sheet УШЯИ.467444.130Э3_1-R1; Datasheet: https://www.murata.com/en-eu/products/productdetail?partno=GRM21BR71H104KA01%23; Capacitance: 0,1 µF; Case / Package: 0805 [2012 Metric]; Height: 1.4mm; Weight, kg: 0,000006
  C69: ClassName: DA8
  C70: ClassName: DA9
  C71: ClassName: DA7
C59 = Cap_14: as C2 on sheet УШЯИ.467444.130Э3_1-R1; Datasheet: https://datasheets.kyocera-avx.com/TAJ.pdf; Capacitance: 4,7 µF; Case / Package: 1210 [3528-21 Metric]; Height: 2mm; Weight, kg: 0,000016
C60 C61 = Cap_69: Неполярный конденсатор; Manufacturer: Murata; ID: Cap_69; Component Name: Конденсатор GRM2165C1H200J; Voltage: 50V; Tolerance: ±5%; Datasheet: chrome-extension://efaidnbmnnnibpcajpcglclefindmkaj/https://static.chipdip.ru/lib/235/DOC000235066.pdf; Capacitance: 20 pF; Case / Package: 0805 [2012 Metric]; Height: 1.4mm; Weight, kg: 0,000006
C62 C64 C95 = Cap_56: as C16 on sheet УШЯИ.467444.130Э3_1-R1; Datasheet: https://datasheets.kyocera-avx.com/TAJ.pdf; Capacitance: 10 µF; Case / Package: 1210 [3528-21 Metric]; Height: 2mm; Weight, kg: 0,000016
C66 C67 = Cap_16: Полярный конденсатор; Manufacturer: AVX; ID: Cap_16; Component Name: Конденсатор TAJA225M016; Voltage: 16V / 10V; Tolerance: ±20%; Datasheet: https://datasheets.kyocera-avx.com/TAJ.pdf; Capacitance: 2,2 µF; Case / Package: 1206 [3216-18 Metric]; Height: 1.7mm; Weight, kg: 0,000016
DA4 = IC_1: as DA1 on sheet УШЯИ.467444.130Э3_1-R1; Device: LD1117AS33TR; Datasheet: https://www.st.com/content/ccc/resource/technical/document/datasheet/a5/c3/3f/c9/2b/15/40/49/CD00002116.pdf/files/CD00002116.pdf/jcr:content/translations/en.CD00002116.pdf; Case / Package: SOT-223; Height: 1.9mm; Weight, kg: 0,0045
DA5-DA9 = IC_11: IC, Transceiver, RS422/RS485, 1 Driver, 1 Receiver, 4.75 V to 5.25 V, -40°C to 125°C; Manufacturer: Analog Devices; ID: IC_11; Component Name: Микросхема ADM483AR; Device: ADM483AR; Datasheet: https://www.analog.com/media/en/technical-documentation/data-sheets/ADM383.pdf; Case / Package: SOIC-8; Height: 1.75mm; Weight, kg: 0,0002
  DA7: ClassName: DA7
  DA8: ClassName: DA8
  DA9: ClassName: DA9
DD4 = IC_15: IC, ARM Cortex-M4, 168 MHz, 1 MB ROM, 192 kB RAM, -40°C to 85°C; Manufacturer: STMicroelectronics; ID: IC_15; Component Name: Микросхема STM32F407ZGTx; Device: STM32F429VIT6STM32F407ZGTx; Datasheet: https://www.st.com/resource/en/datasheet/dm00037051.pdf; Case / Package: 144-QFP (20x20); Height: 1.6mm; Weight, kg: 0,0011
L9 L10 = Ind_5: as L2 on sheet УШЯИ.467444.130Э3_1-R1; Datasheet: https://www.vishay.com/docs/34025/ilbb0805.pdf; Case / Package: 0805 [2012 Metric]; Height: 1.1mm; Weight, kg: 0,00006
R10-R15 R17 R19-R21 = Res_5: as R4 on sheet УШЯИ.467444.130Э3_1-R1; Resistance: 10k; Case / Package: 0805 [2012 Metric]; Height: 0.7mm; Weight, kg: 0,000006
  R19: ClassName: DA7
  R20: ClassName: DA8
  R21: ClassName: DA9
R16 R18 R22-R24 = Res_10: ID: Res_10; Component Name: Резистор 0805-100 Ом ±5%; Tolerance: ±5%; Resistance: 100R; Case / Package: 0805 [2012 Metric]; Height: 0.7mm; Weight, kg: 0,000006
  R22: ClassName: DA8
  R23: ClassName: DA9
  R24: ClassName: DA7
TP7-TP12 = Pad_13: ID: Pad_13; Component Name: TP_DSP_1.3
XP2 = Conn_2: Male, 6 pin, 1 row, Vertical, Board-to-Board, 2.54 mm; Manufacturer: TE Connectivity; ID: Conn_2; Component Name: Вилка AMPMODU II 280372-2; Catalogue: TE Internal 280372-2; Крепёж: Не нужно; Device: AMPMODU II 280372-2; Datasheet: https://www.te.com/usa-en/product-280372-2.datasheet.pdf; Height: 12.8mm; Weight, kg: 0,0013
ZQ1 = Rez_1: Manufacturer: Jauch Quartz GmbH; ID: Rez_1; Component Name: Резонатор Q 25.0JXS63-12-30/30-FU; Frequency: 25MHz; Device: Q 25.0JXS63-12-30/30-FU; Datasheet: https://www.jauch.com/downloadfile/57fdedace792c_938dbcb9dba48037cc0e/jxs63-200613.pdf; Height: 1mm; Weight, kg: 0,001

## Sheet УШЯИ.467444.130Э3_4-R1.SchDoc
size 420 x 297 mm; SheetNumber: 4; SheetTotal: 5
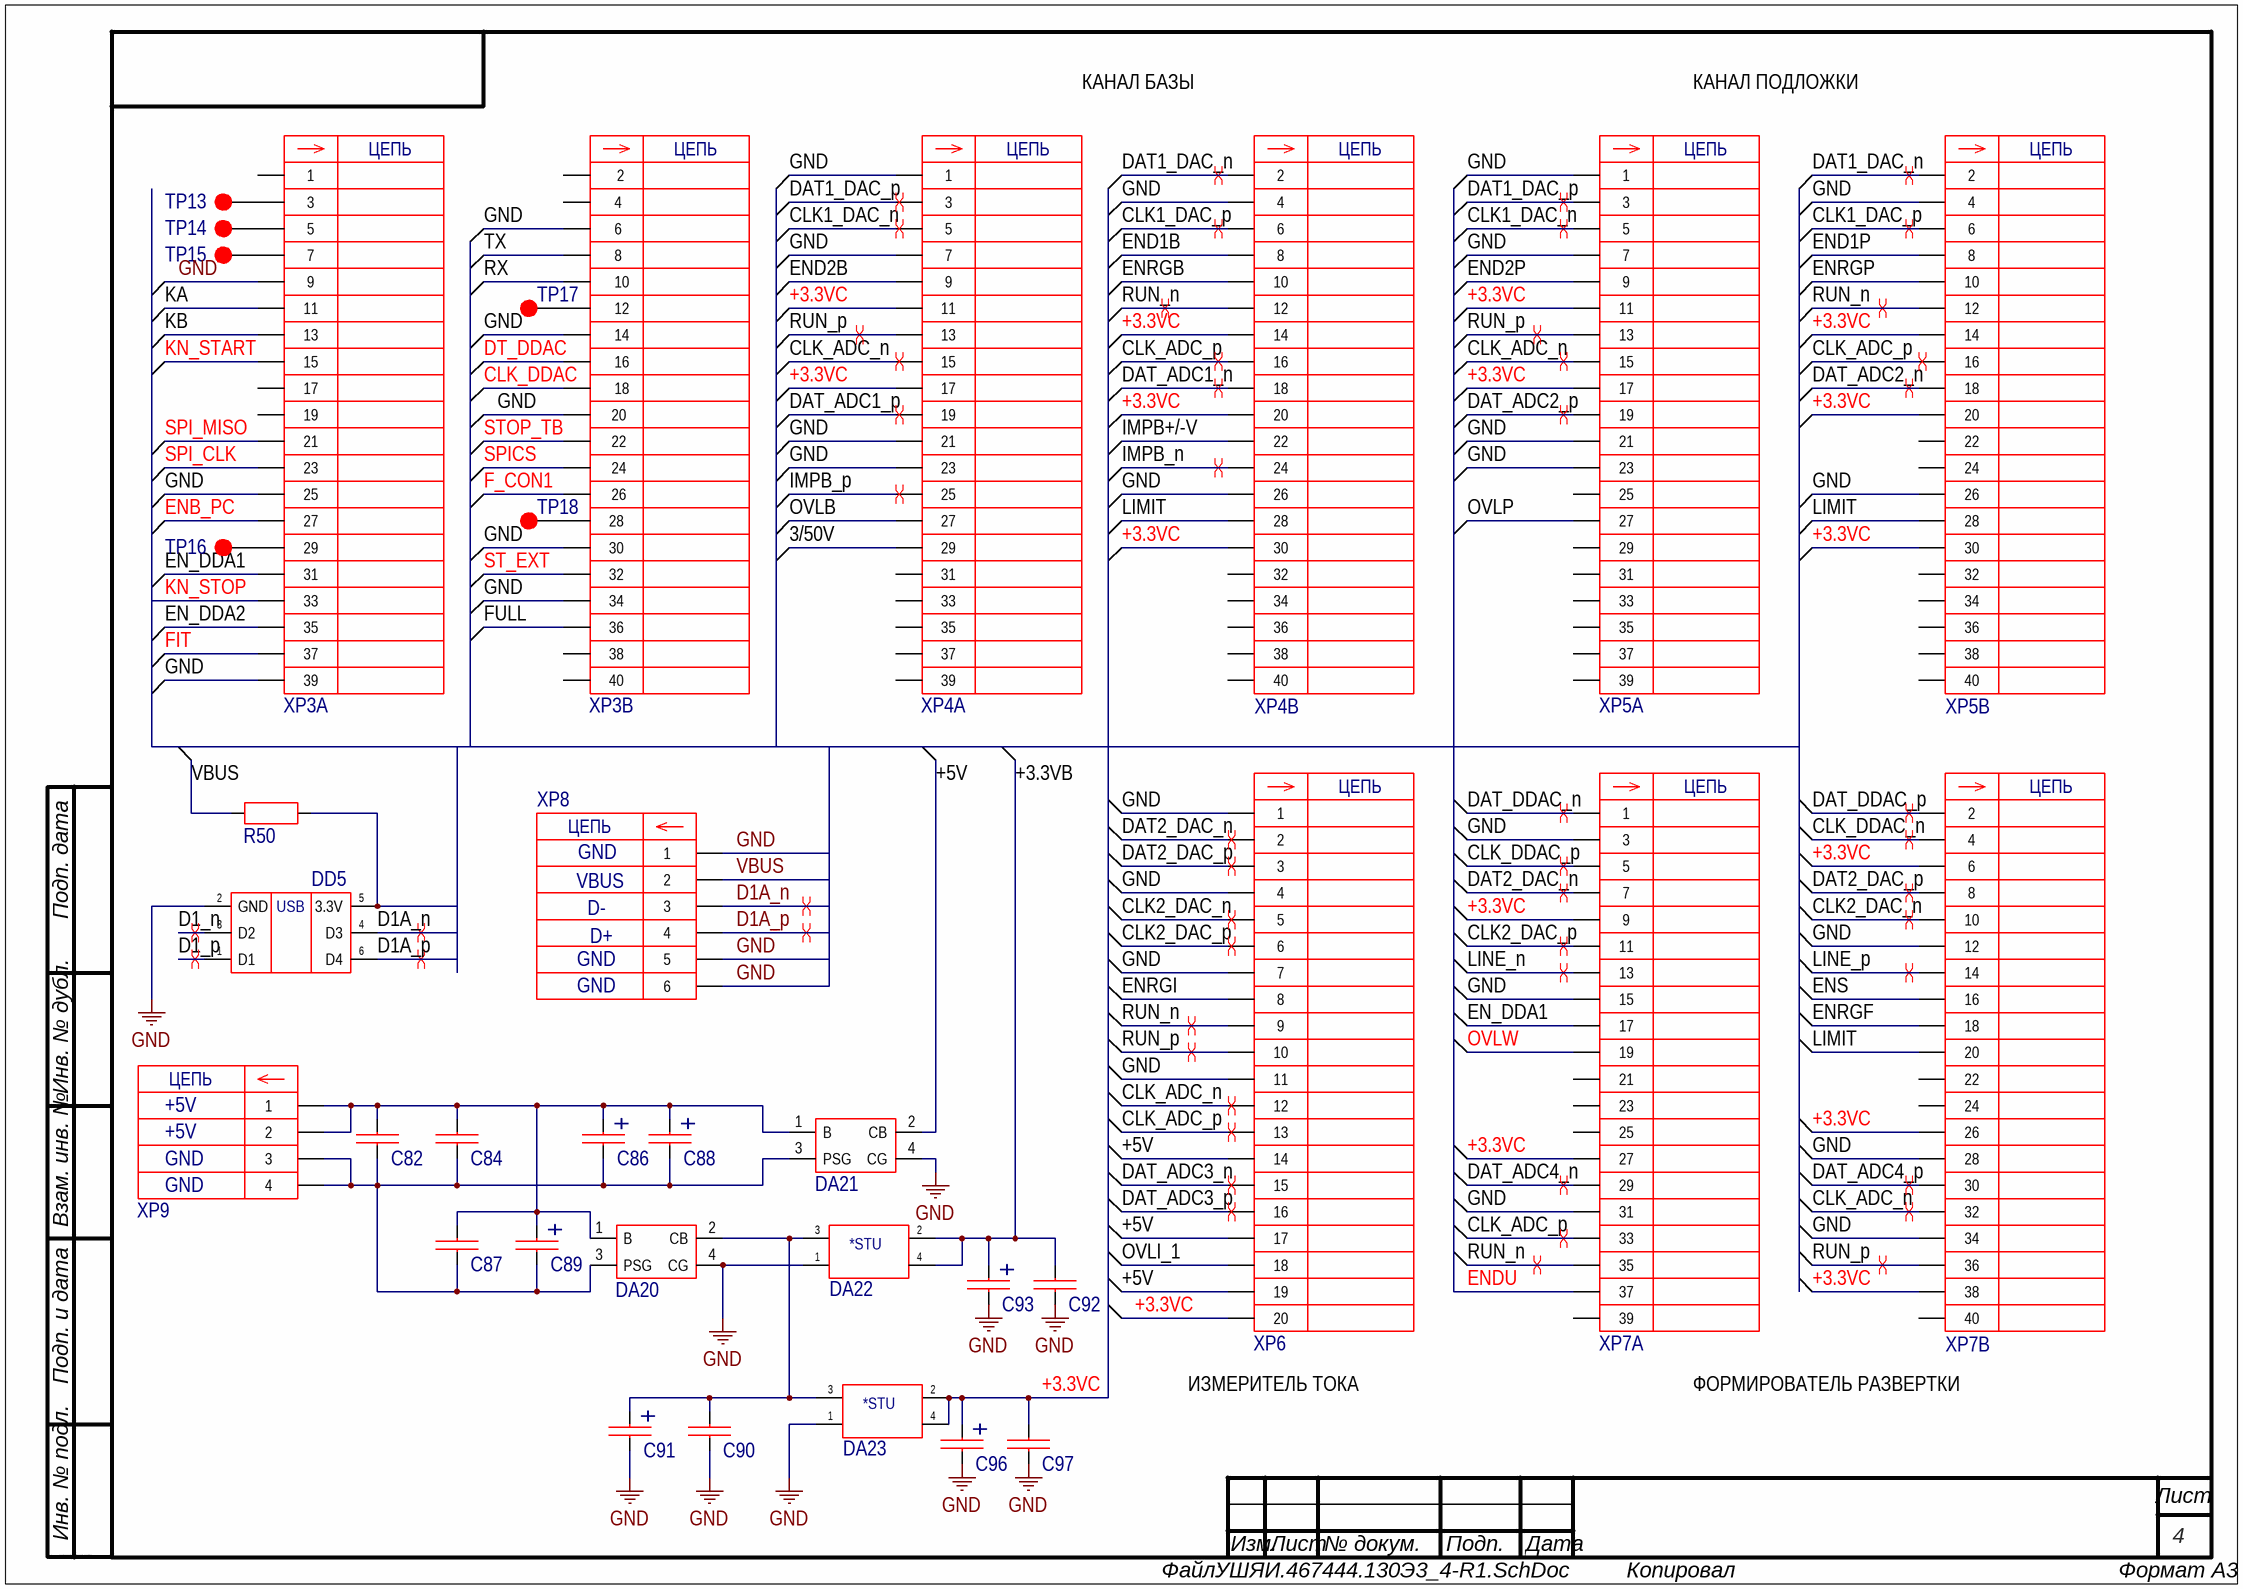
[diagram p2: УШЯИ.467444.130Э3_4-R1.SchDoc]

### Parts
C82  0,1 µF  [C_0805 [2012 Metric]]  (value not drawn)
C84  0,1 µF  [C_0805 [2012 Metric]]  (value not drawn)
C86  1000 µF  [С_EXR_10x21]  (value not drawn)
C87  0,1 µF  [C_0805 [2012 Metric]]  (value not drawn)
C88  10 µF  [C+_1210 [3528-21 Metric]]  (value not drawn)
C89  10 µF  [C+_1210 [3528-21 Metric]]  (value not drawn)
C90  0,1 µF  [C_0805 [2012 Metric]]  (value not drawn)
C91  10 µF  [C+_1210 [3528-21 Metric]]  (value not drawn)
C92  (no value)  [C_0805 [2012 Metric]]
C93  (no value)  [C+_1210 [3528-21 Metric]]
C96  (no value)  [C+_1210 [3528-21 Metric]]
C97  (no value)  [C_0805 [2012 Metric]]
DA20  BNX028-01  [F_BNX028-01]  (value not drawn)
DA21  BNX028-01  [F_BNX028-01]  (value not drawn)
DA22  LD1117AS33TR  [SOT-223]  (value not drawn)
DA23  LD1117AS33TR  [SOT-223]  (value not drawn)
DD5  USBUF01W6  [SOT-323-6]  (value not drawn)
R50  30R  [R_0805 [2012 Metric]]  (value not drawn)
TP13  (no value)  [DSP_1.3]  (no BOM)
TP14  (no value)  [DSP_1.3]  (no BOM)
TP15  (no value)  [DSP_1.3]  (no BOM)
TP16  (no value)  [DSP_1.3]  (no BOM)
TP17  (no value)  [DSP_1.3]  (no BOM)
TP18  (no value)  [DSP_1.3]  (no BOM)
XP3  BH-40  [BH-40]  (value not drawn)  (parts A,B of 2)
XP4  BH2-40  [BH2-40]  (value not drawn)  (parts A,B of 2)
XP5  BH2-40  [BH2-40]  (value not drawn)  (parts A,B of 2)
XP6  BH2-20R  [BH2-20R]  (value not drawn)
XP7  BH2-40  [BH2-40]  (value not drawn)  (parts A,B of 2)
XP8  AMPMODU II 280372-2  [AMP II-280372-2]  (value not drawn)
XP9  AMPMODU II 280371-2  [AMP II-280371-2]  (value not drawn)

### Nets
+5V: DA21.2(CB) XP6.14 XP6.17 XP6.19
GND: C90.2 C91.- C92.1 C93.- C96.- C97.1 DA20.4(CG) DA21.4(CG) DA22.1(ADJ/GND) DA23.1(ADJ/GND) DD5.2(GND) XP3.6 XP3.9 XP3.14 XP3.20 XP3.25 XP3.30 XP3.34 XP3.39 XP4.1 XP4.4 XP4.7 XP4.21 XP4.23 XP4.26 XP5.1 XP5.4 XP5.7 XP5.21 XP5.23 XP5.26 XP6.1 XP6.4 XP6.7 XP6.11 XP7.3 XP7.12 XP7.15 XP7.28 XP7.31 XP7.34 XP8.1 XP8.5 XP8.6
3/50V: XP4.29
+3.3VB: C92.2 C93.+ DA22.2(VOUT) DA22.4(VOUT)
+3.3VC: C96.+ C97.2 DA23.2(VOUT) DA23.4(VOUT) XP4.11 XP4.14 XP4.17 XP4.20 XP4.30 XP5.11 XP5.14 XP5.17 XP5.20 XP5.30 XP6.20 XP7.6 XP7.9 XP7.26 XP7.27 XP7.38
CLK1_DAC_n: XP4.5 XP5.5
CLK1_DAC_p: XP4.6 XP5.6
CLK2_DAC_n: XP6.5 XP7.10
CLK2_DAC_p: XP6.6 XP7.11
CLK_ADC_n: XP4.15 XP5.15 XP6.12 XP7.32
CLK_ADC_p: XP4.16 XP5.16 XP6.13 XP7.33
CLK_DDAC: XP3.18
CLK_DDAC_n: XP7.4
CLK_DDAC_p: XP7.5
D1_n: DD5.3(D2)
D1_p: DD5.1(D1)
D1A_n: DD5.4(D3) XP8.3
D1A_p: DD5.6(D4) XP8.4
DAT1_DAC_n: XP4.2 XP5.2
DAT1_DAC_p: XP4.3 XP5.3
DAT2_DAC_n: XP6.2 XP7.7
DAT2_DAC_p: XP6.3 XP7.8
DAT_ADC1_n: XP4.18
DAT_ADC1_p: XP4.19
DAT_ADC2_n: XP5.18
DAT_ADC2_p: XP5.19
DAT_ADC3_n: XP6.15
DAT_ADC3_p: XP6.16
DAT_ADC4_n: XP7.29
DAT_ADC4_p: XP7.30
DAT_DDAC_n: XP7.1
DAT_DDAC_p: XP7.2
DT_DDAC: XP3.16
EN_DDA1: XP3.31 XP7.17
EN_DDA2: XP3.35
ENB_PC: XP3.27
END1B: XP4.8
END1P: XP5.8
END2B: XP4.9
END2P: XP5.9
ENDU: XP7.37
ENRGB: XP4.10
ENRGF: XP7.18
ENRGI: XP6.8
ENRGP: XP5.10
ENS: XP7.16
F_CON1: XP3.26
FIT: XP3.37
FULL: XP3.36
IMPB+/-V: XP4.22
IMPB_n: XP4.24
IMPB_p: XP4.25
KA: XP3.11
KB: XP3.13
KN_START: XP3.15
KN_STOP: XP3.33
LIMIT: XP4.28 XP5.28 XP7.20
LINE_n: XP7.13
LINE_p: XP7.14
OVLB: XP4.27
OVLI_1: XP6.18
OVLP: XP5.27
OVLW: XP7.19
RUN_n: XP4.12 XP5.12 XP6.9 XP7.35
RUN_p: XP4.13 XP5.13 XP6.10 XP7.36
RX: XP3.10
SPI_CLK: XP3.23
SPI_MISO: XP3.21
SPICS: XP3.24
ST_EXT: XP3.32
Stop_TB: XP3.22
TX: XP3.8
VBUS: R50.1 XP8.2
NetC82_1: C82.1 C84.1 C86.+ C87.2 C88.+ C89.+ DA20.1(B) DA21.1(B) XP9.1 XP9.2
NetC82_2: C82.2 C84.2 C86.- C87.1 C88.- C89.- DA20.3(PSG) DA21.3(PSG) XP9.3 XP9.4
NetC90_1: C90.1 C91.+ DA20.2(CB) DA22.3(VIN) DA23.3(VIN)
NetDD5_5: DD5.5(3.3V) R50.2
NetTP13_1: TP13.1 XP3.3
NetTP14_1: TP14.1 XP3.5
NetTP15_1: TP15.1 XP3.7
NetTP16_1: TP16.1 XP3.29
NetTP17_1: TP17.1 XP3.12
NetTP18_1: TP18.1 XP3.28

Not connected (* = marked no-connect by the designer): XP3 1 2 4 17 19 38 40; XP4 31 32 33 34 35 36 37 38 39 40; XP5 22 24 25 29 31 32 33 34 35 36 37 38 39 40; XP7 21 22 23 24 25 39 40

### Layout directives
differential pair: CLK1_DAC_n, CLK1_DAC_p, CLK2_DAC_n, CLK2_DAC_p, CLK_ADC_n, CLK_ADC_p, CLK_DDAC_n, CLK_DDAC_p, D1_n, D1_p, D1A_n, D1A_p, DAT1_DAC_n, DAT1_DAC_p, DAT2_DAC_n, DAT2_DAC_p, DAT_ADC1_n, DAT_ADC1_p, DAT_ADC2_n, DAT_ADC2_p, DAT_ADC3_n, DAT_ADC3_p, DAT_ADC4_n, DAT_ADC4_p, DAT_DDAC_n, DAT_DDAC_p, IMPB_n, IMPB_p, LINE_n, LINE_p, RUN_n, RUN_p

### Notes on the sheet
- КАНАЛ БАЗЫ
- КАНАЛ ПОДЛОЖКИ
- GND
- VBUS
- D-
- D+
- +5V
- ИЗМЕРИТЕЛЬ ТОКА
- ФОРМИРОВАТЕЛЬ РАЗВЕРТКИ
- Подп. дата
- Инв. № дубл.
- Взам. инв. №
- Подп. и дата
- Инв. № подл.
- Изм.
- Лист
- № докум.
- Подп.
- Дата
- ALTIUM GOSTBOM2.0 KEV
- Файл:
- Копировал
- Формат А3
- (in symbol Conn_2) ЦЕПЬ
- (in symbol Conn_3) ЦЕПЬ
- (in symbol Conn_29, part A) ЦЕПЬ
- (in symbol Conn_29, part B) ЦЕПЬ
- (in symbol Conn_30, part A) ЦЕПЬ
- (in symbol Conn_30, part B) ЦЕПЬ
- (in symbol Conn_31) ЦЕПЬ
- (in symbol IC_1) *STU
- (in symbol IC_5) USB

### Library data of the parts
C82 C84 C87 C90 = Cap_60: as C1 on sheet УШЯИ.467444.130Э3_1-R1; Datasheet: https://www.murata.com/en-eu/products/productdetail?partno=GRM21BR71H104KA01%23; Capacitance: 0,1 µF; Case / Package: 0805 [2012 Metric]; Height: 1.4mm; Weight, kg: 0,000006
C86 = Cap_70: Полярный конденсатор; Manufacturer: Hitano; ID: Cap_70; Component Name: Конденсатор EXR102M16B; Voltage: 16V; Tolerance: ± 20%; Datasheet: chrome-extension://efaidnbmnnnibpcajpcglclefindmkaj/https://static.chipdip.ru/lib/934/DOC044934708.pdf; Capacitance: 1000 µF; Height: 21mm; Weight, kg: 0,003
C88 C89 C91 = Cap_56: as C16 on sheet УШЯИ.467444.130Э3_1-R1; Datasheet: https://datasheets.kyocera-avx.com/TAJ.pdf; Capacitance: 10 µF; Case / Package: 1210 [3528-21 Metric]; Height: 2mm; Weight, kg: 0,000016
C92 C97 = Cap_60: Неполярный конденсатор; Manufacturer: Murata; ID: Cap_60; Component Name: Конденсатор GRM21BR71H104KA01L; Capacitance: 0,1 µF; Voltage: 50V; Tolerance: ±10%; Datasheet: https://www.murata.com/en-eu/products/productdetail?partno=GRM21BR71H104KA01%23; Case / Package: 0805 [2012 Metric]; Height: 1.4mm; Weight, kg: 0,000006
C93 C96 = Cap_56: Полярный конденсатор; Manufacturer: KYOCERA AVX; ID: Cap_56; Component Name: Конденсатор TAJB106M020; Capacitance: 10 µF; Voltage: 20V / 10V; Tolerance: ±20%; Datasheet: https://datasheets.kyocera-avx.com/TAJ.pdf; Case / Package: 1210 [3528-21 Metric]; Height: 2mm; Weight, kg: 0,000016
DA20 DA21 = Filt_2: 16В, 35дБ; Manufacturer: Murata Electronics; ID: Filt_2; Component Name: Фильтр BNX028-01; Current: 20А; Datasheet: https://static.chipdip.ru/lib/614/DOC034614186.pdf; Height: 3.7mm; Weight, kg: 0,001; Device: BNX028-01
DA22 DA23 = IC_1: as DA1 on sheet УШЯИ.467444.130Э3_1-R1; Device: LD1117AS33TR; Datasheet: https://www.st.com/content/ccc/resource/technical/document/datasheet/a5/c3/3f/c9/2b/15/40/49/CD00002116.pdf/files/CD00002116.pdf/jcr:content/translations/en.CD00002116.pdf; Case / Package: SOT-223; Height: 1.9mm; Weight, kg: 0,0045
DD5 = IC_5: EMI Filter, 2-Channel, USB Upstream Terminator, ESD Protection; Manufacturer: STMicroelectronics; ID: IC_5; Component Name: Микросхема USBUF01W6; Catalogue: FARNELL 2341662; Device: USBUF01W6; Datasheet: https://www.farnell.com/datasheets/1964274.pdf; Case / Package: SOT-323-6; Height: 1.1mm; Weight, kg: 0,000006
R50 = Res_89: ID: Res_89; Component Name: Резистор 0805-30 Ом ±5%; Tolerance: ±5%; Resistance: 30R; Case / Package: 0805 [2012 Metric]; Height: 0.7mm; Weight, kg: 0,000006
TP13-TP18 = Pad_13: ID: Pad_13; Component Name: TP_DSP_1.3
XP3 = Conn_30: Male, 40 pins, 2 rows, Vertical, DS1013-40S, 2.54 mm; Manufacturer: Connfly electronic; Component Name: Вилка BH-40; Catalogue: ChipDip 57941; Крепёж: Не нужно; ID: Conn_30; Device: BH-40; Datasheet: https://static.chipdip.ru/lib/525/DOC059525716.pdf; Height: 9.1mm; Weight, kg: 0,0045
XP4 XP5 XP7 = Conn_29: Male, 40 pins, 2 rows, Vertical, DS1014-40, 2 mm; Manufacturer: Connfly electronic; Component Name: Вилка BH2-40; Catalogue: ChipDip 9000019617; Крепёж: Не нужно; ID: Conn_29; Device: BH2-40; Datasheet: https://static.chipdip.ru/lib/525/DOC059525726.pdf; Height: 5.8mm; Weight, kg: 0,0014
XP6 = Conn_31: Male, 20 pins, 2 rows, Right Angle, DS1014-20RF1B-B, 2 mm; Manufacturer: Connfly electronic; Component Name: Вилка BH2-20R; Catalogue: ChipDip 8027300167; Крепёж: Не нужно; ID: Conn_31; Device: BH2-20R; Datasheet: https://static.chipdip.ru/lib/525/DOC059525726.pdf; Height: 5.6mm; Weight, kg: 0,0016
XP8 = Conn_2: as XP2 on sheet УШЯИ.467444.130Э3_2-R1; Device: AMPMODU II 280372-2; Datasheet: https://www.te.com/usa-en/product-280372-2.datasheet.pdf; Height: 12.8mm; Weight, kg: 0,0013
XP9 = Conn_3: Male, 4 pin, 1 row, Vertical, Board-to-Board, 2.54 mm; Manufacturer: TE Connectivity; ID: Conn_3; Component Name: Вилка AMPMODU II 280371-2; Catalogue: TE Internal 280371-2; Крепёж: Не нужно; Device: AMPMODU II 280371-2; Datasheet: https://www.te.com/usa-en/product-280371-2.datasheet.pdf; Height: 12.8mm; Weight, kg: 0,001

## Sheet УШЯИ.467444.130Э3_5-R1.SchDoc
size 420 x 297 mm; SheetNumber: 5; SheetTotal: 5
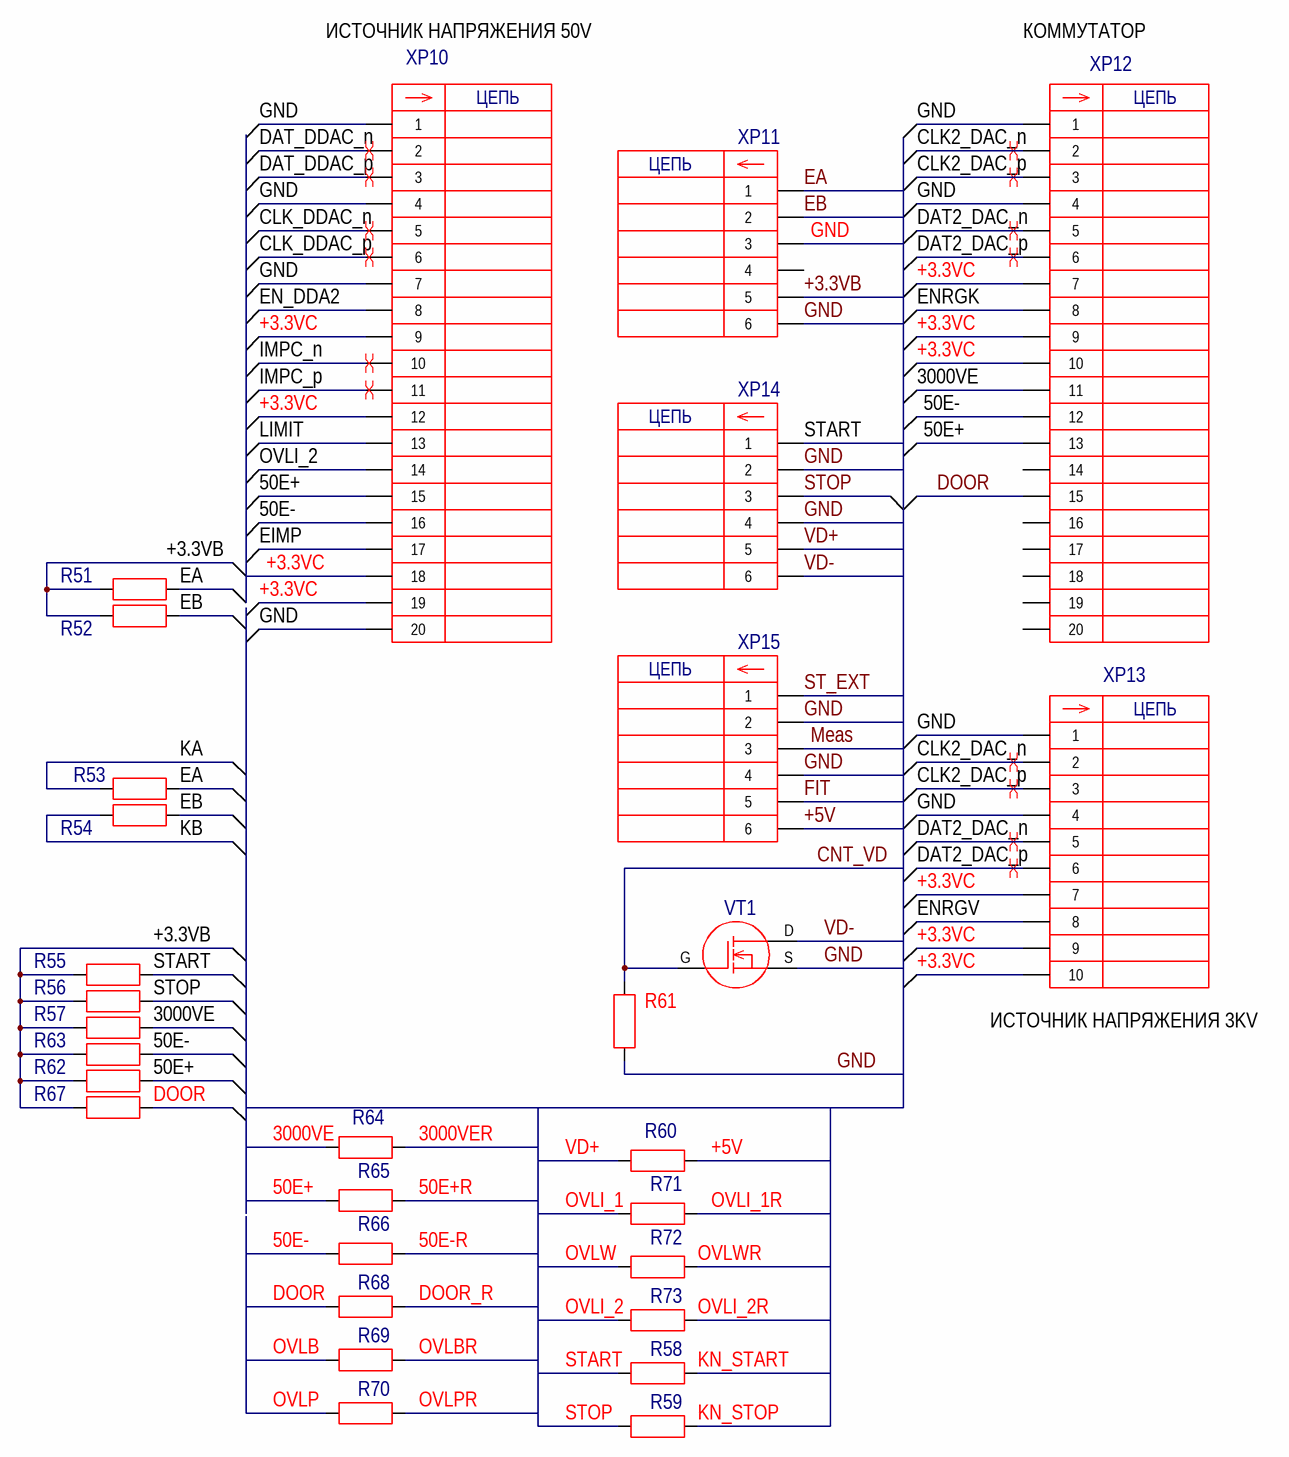
[diagram p3: УШЯИ.467444.130Э3_5-R1.SchDoc]

### Parts
R51  5,1k  [R_0805 [2012 Metric]]  (value not drawn)
R52  5,1k  [R_0805 [2012 Metric]]  (value not drawn)
R53  1k  [R_0805 [2012 Metric]]  (value not drawn)
R54  1k  [R_0805 [2012 Metric]]  (value not drawn)
R55  5,1k  [R_0805 [2012 Metric]]  (value not drawn)
R56  5,1k  [R_0805 [2012 Metric]]  (value not drawn)
R57  10k  [R_0805 [2012 Metric]]  (value not drawn)
R58  (no value)  [R_0805 [2012 Metric]]
R59  (no value)  [R_0805 [2012 Metric]]
R60  150R  [R_0805 [2012 Metric]]  (value not drawn)
R61  10k  [R_0805 [2012 Metric]]  (value not drawn)
R62  3,6k  [R_0805 [2012 Metric]]  (value not drawn)
R63  3,6k  [R_0805 [2012 Metric]]  (value not drawn)
R64  1k  [R_0805 [2012 Metric]]  (value not drawn)
R65  1k  [R_0805 [2012 Metric]]  (value not drawn)
R66  1k  [R_0805 [2012 Metric]]  (value not drawn)
R67  1k  [R_0805 [2012 Metric]]  (value not drawn)
R68  1k  [R_0805 [2012 Metric]]  (value not drawn)
R69  1k  [R_0805 [2012 Metric]]  (value not drawn)
R70  1k  [R_0805 [2012 Metric]]  (value not drawn)
R71  1k  [R_0805 [2012 Metric]]  (value not drawn)
R72  1k  [R_0805 [2012 Metric]]  (value not drawn)
R73  1k  [R_0805 [2012 Metric]]  (value not drawn)
VT1  NDS7002A  [SOT-23-3_[TO-236AB]_Transistor_n]  (value not drawn)
XP10  BH2-20R  [BH2-20R]  (value not drawn)
XP11  AMPMODU II 280372-2  [AMP II-280372-2]  (value not drawn)
XP12  BH2-20R  [BH2-20R]  (value not drawn)
XP13  BH2-10R  [BH2-10R]  (value not drawn)
XP14  AMPMODU II 280372-2  [AMP II-280372-2]  (value not drawn)
XP15  AMPMODU II 280372-2  [AMP II-280372-2]  (value not drawn)

### Nets
+5V: R60.2 XP15.6
GND: R61.1 VT1.S(И) XP10.1 XP10.4 XP10.7 XP10.20 XP11.3 XP11.6 XP12.1 XP12.4 XP13.1 XP13.4 XP14.2 XP14.4 XP15.2 XP15.4
50E+: R62.2 R65.1 XP10.15 XP12.13
50E+R: R65.2
50E-: R63.2 R66.1 XP10.16 XP12.12
50E-R: R66.2
3000VE: R57.2 R64.1 XP12.11
3000VER: R64.2
+3.3VB: R51.1 R52.1 R55.1 R56.1 R57.1 R62.1 R63.1 R67.1 XP11.5
+3.3VC: XP10.9 XP10.12 XP10.18 XP10.19 XP12.7 XP12.9 XP12.10 XP13.7 XP13.9 XP13.10
CLK2_DAC_n: XP12.2 XP13.2
CLK2_DAC_p: XP12.3 XP13.3
CLK_DDAC_n: XP10.5
CLK_DDAC_p: XP10.6
CNT_VD: R61.2 VT1.G(З)
DAT2_DAC_n: XP12.5 XP13.5
DAT2_DAC_p: XP12.6 XP13.6
DAT_DDAC_n: XP10.2
DAT_DDAC_p: XP10.3
DOOR: R67.2 R68.1 XP12.15
DOOR_R: R68.2
EA: R51.2 R53.2 XP11.1
EB: R52.2 R54.2 XP11.2
EIMP: XP10.17
EN_DDA2: XP10.8
ENRGK: XP12.8
ENRGV: XP13.8
FIT: XP15.5
IMPC_n: XP10.10
IMPC_p: XP10.11
KA: R53.1
KB: R54.1
KN_START: R58.2
KN_STOP: R59.2
LIMIT: XP10.13
Meas: XP15.3
OVLB: R69.1
OVLBR: R69.2
OVLI_1: R71.1
OVLI_1R: R71.2
OVLI_2: R73.1 XP10.14
OVLI_2R: R73.2
OVLP: R70.1
OVLPR: R70.2
OVLW: R72.1
OVLWR: R72.2
ST_EXT: XP15.1
START: R55.2 R58.1 XP14.1
STOP: R56.2 R59.1 XP14.3
VD+: R60.1 XP14.5
VD-: VT1.D(C) XP14.6

Not connected (* = marked no-connect by the designer): XP11 4; XP12 14 16 17 18 19 20

### Layout directives
differential pair: CLK2_DAC_n, CLK2_DAC_p, CLK_DDAC_n, CLK_DDAC_p, DAT2_DAC_n, DAT2_DAC_p, DAT_DDAC_n, DAT_DDAC_p, IMPC_n, IMPC_p

### Notes on the sheet
- ИСТОЧНИК НАПРЯЖЕНИЯ 50V
- КОММУТАТОР
- (near XP13) ИСТОЧНИК НАПРЯЖЕНИЯ 3KV
- Подп. дата
- Инв. № дубл.
- Взам. инв. №
- Подп. и дата
- Инв. № подл.
- Изм.
- Лист
- № докум.
- Подп.
- Дата
- ALTIUM GOSTBOM2.0 KEV
- Файл:
- Копировал
- Формат А3
- (in symbol Conn_2) ЦЕПЬ
- (in symbol Conn_31) ЦЕПЬ
- (in symbol Conn_32) ЦЕПЬ

### Library data of the parts
R51 R52 R55 R56 = Res_163: Component Name: Резистор 0805-5,1 кОм ±5%; Tolerance: ±5%; ID: Res_163; Resistance: 5,1k; Height: 0.7mm; Weight, kg: 0,000006; Case / Package: 0805 [2012 Metric]
R53 R54 R64-R73 = Res_11: as R3 on sheet УШЯИ.467444.130Э3_1-R1; Resistance: 1k; Height: 0.7mm; Weight, kg: 0,000006; Case / Package: 0805 [2012 Metric]
R57 = Res_57: ID: Res_57; Component Name: Резистор 0805-10 кОм ±1%; Tolerance: ±1%; Resistance: 10k; Height: 0.7mm; Weight, kg: 0,000006; Case / Package: 0805 [2012 Metric]
R58 R59 = Res_11: ID: Res_11; Component Name: Резистор 0805-1 кОм ±5%; Resistance: 1k; Tolerance: ±5%; Height: 0.7mm; Weight, kg: 0,000006; Case / Package: 0805 [2012 Metric]
R60 = Res_165: Component Name: Резистор 0805-150 Ом ±5%; Tolerance: ±5%; ID: Res_165; Resistance: 150R; Height: 0.7mm; Weight, kg: 0,000006; Case / Package: 0805 [2012 Metric]
R61 = Res_5: as R4 on sheet УШЯИ.467444.130Э3_1-R1; Resistance: 10k; Case / Package: 0805 [2012 Metric]; Height: 0.7mm; Weight, kg: 0,000006
R62 R63 = Res_164: Component Name: Резистор 0805-3,6 кОм ±5%; Tolerance: ±5%; ID: Res_164; Resistance: 3,6k; Height: 0.7mm; Weight, kg: 0,000006; Case / Package: 0805 [2012 Metric]
VT1 = Trans_1: Транзистор n-канальный, изолированный затвор; Manufacturer: Onsemi; Component Name: Транзистор NDS7002A; Catalogue: DIGI-KEY NDS7002ATR-ND; ID: Trans_1; Device: NDS7002A; Datasheet: https://www.onsemi.com/pdf/datasheet/nds7002a-d.pdf; Height: 1.11mm; Weight, kg: 0,000008
XP10 XP12 = Conn_31: as XP6 on sheet УШЯИ.467444.130Э3_4-R1; ID: Conn_31; Device: BH2-20R; Datasheet: https://static.chipdip.ru/lib/525/DOC059525726.pdf; Height: 5.6mm; Weight, kg: 0,0016
XP11 XP14 XP15 = Conn_2: as XP2 on sheet УШЯИ.467444.130Э3_2-R1; Device: AMPMODU II 280372-2; Datasheet: https://www.te.com/usa-en/product-280372-2.datasheet.pdf; Height: 12.8mm; Weight, kg: 0,0013
XP13 = Conn_32: Male, 10 pins, 2 rows, Vertical, DS1014-10RF1B-B, 2 mm; Manufacturer: Connfly electronic; Component Name: Вилка BH2-10R; Catalogue: ChipDip 8144058573; Крепёж: Не нужно; ID: Conn_32; Device: BH2-10R; Datasheet: https://static.chipdip.ru/lib/525/DOC059525726.pdf; Height: 5.6mm; Weight, kg: 0,00071

## Nets that join several sheets
+5V: УШЯИ.467444.130Э3_1-R1 (6 pins), УШЯИ.467444.130Э3_2-R1 (17 pins), УШЯИ.467444.130Э3_4-R1 (DA21.2 XP6.14 XP6.17 XP6.19), УШЯИ.467444.130Э3_5-R1 (R60.2 XP15.6)
GND: УШЯИ.467444.130Э3_1-R1 (70 pins), УШЯИ.467444.130Э3_2-R1 (49 pins), УШЯИ.467444.130Э3_4-R1 (44 pins), УШЯИ.467444.130Э3_5-R1 (16 pins)
3/50V: УШЯИ.467444.130Э3_2-R1 (DD4.57), УШЯИ.467444.130Э3_4-R1 (XP4.29)
50E+R: УШЯИ.467444.130Э3_2-R1 (DD4.50), УШЯИ.467444.130Э3_5-R1 (R65.2)
50E-R: УШЯИ.467444.130Э3_2-R1 (DD4.49), УШЯИ.467444.130Э3_5-R1 (R66.2)
3000VER: УШЯИ.467444.130Э3_2-R1 (DD4.44), УШЯИ.467444.130Э3_5-R1 (R64.2)
+3.3VB: УШЯИ.467444.130Э3_4-R1 (C92.2 C93.+ DA22.2 DA22.4), УШЯИ.467444.130Э3_5-R1 (9 pins)
+3.3VC: УШЯИ.467444.130Э3_4-R1 (20 pins), УШЯИ.467444.130Э3_5-R1 (10 pins)
A0_RG: УШЯИ.467444.130Э3_1-R1 (DD1.71), УШЯИ.467444.130Э3_2-R1 (DD4.90)
A1_RG: УШЯИ.467444.130Э3_1-R1 (DD1.70), УШЯИ.467444.130Э3_2-R1 (DD4.91)
CLK1_DAC_n: УШЯИ.467444.130Э3_2-R1 (DA8.7 R22.1), УШЯИ.467444.130Э3_4-R1 (XP4.5 XP5.5)
CLK1_DAC_p: УШЯИ.467444.130Э3_2-R1 (DA8.6 R22.2), УШЯИ.467444.130Э3_4-R1 (XP4.6 XP5.6)
CLK2_DAC_n: УШЯИ.467444.130Э3_2-R1 (DA9.7 R23.1), УШЯИ.467444.130Э3_4-R1 (XP6.5 XP7.10), УШЯИ.467444.130Э3_5-R1 (XP12.2 XP13.2)
CLK2_DAC_p: УШЯИ.467444.130Э3_2-R1 (DA9.6 R23.2), УШЯИ.467444.130Э3_4-R1 (XP6.6 XP7.11), УШЯИ.467444.130Э3_5-R1 (XP12.3 XP13.3)
CLK_DDAC_n: УШЯИ.467444.130Э3_4-R1 (XP7.4), УШЯИ.467444.130Э3_5-R1 (XP10.5)
CLK_DDAC_p: УШЯИ.467444.130Э3_4-R1 (XP7.5), УШЯИ.467444.130Э3_5-R1 (XP10.6)
CLK_RG: УШЯИ.467444.130Э3_1-R1 (DD1.69), УШЯИ.467444.130Э3_2-R1 (DD4.92)
CNT_VD: УШЯИ.467444.130Э3_2-R1 (DD4.12), УШЯИ.467444.130Э3_5-R1 (R61.2 VT1.G)
D1_n: УШЯИ.467444.130Э3_2-R1 (DD4.103), УШЯИ.467444.130Э3_4-R1 (DD5.3)
D1_p: УШЯИ.467444.130Э3_2-R1 (DD4.104), УШЯИ.467444.130Э3_4-R1 (DD5.1)
DAT1_DAC_n: УШЯИ.467444.130Э3_2-R1 (DA5.7 R16.2), УШЯИ.467444.130Э3_4-R1 (XP4.2 XP5.2)
DAT1_DAC_p: УШЯИ.467444.130Э3_2-R1 (DA5.6 R16.1), УШЯИ.467444.130Э3_4-R1 (XP4.3 XP5.3)
DAT2_DAC_n: УШЯИ.467444.130Э3_2-R1 (DA6.7 R18.2), УШЯИ.467444.130Э3_4-R1 (XP6.2 XP7.7), УШЯИ.467444.130Э3_5-R1 (XP12.5 XP13.5)
DAT2_DAC_p: УШЯИ.467444.130Э3_2-R1 (DA6.6 R18.1), УШЯИ.467444.130Э3_4-R1 (XP6.3 XP7.8), УШЯИ.467444.130Э3_5-R1 (XP12.6 XP13.6)
DAT_DDAC_n: УШЯИ.467444.130Э3_4-R1 (XP7.1), УШЯИ.467444.130Э3_5-R1 (XP10.2)
DAT_DDAC_p: УШЯИ.467444.130Э3_4-R1 (XP7.2), УШЯИ.467444.130Э3_5-R1 (XP10.3)
DAT_RG: УШЯИ.467444.130Э3_1-R1 (DD1.49), УШЯИ.467444.130Э3_2-R1 (DD4.82)
DOOR_R: УШЯИ.467444.130Э3_2-R1 (DD4.140), УШЯИ.467444.130Э3_5-R1 (R68.2)
EIMP: УШЯИ.467444.130Э3_1-R1 (DD1.83), УШЯИ.467444.130Э3_5-R1 (XP10.17)
EN_DDA2: УШЯИ.467444.130Э3_4-R1 (XP3.35), УШЯИ.467444.130Э3_5-R1 (XP10.8)
ENB_PC: УШЯИ.467444.130Э3_2-R1 (DD4.81), УШЯИ.467444.130Э3_4-R1 (XP3.27)
END1B: УШЯИ.467444.130Э3_2-R1 (DD4.29), УШЯИ.467444.130Э3_4-R1 (XP4.8)
END1P: УШЯИ.467444.130Э3_2-R1 (DD4.26), УШЯИ.467444.130Э3_4-R1 (XP5.8)
END2B: УШЯИ.467444.130Э3_2-R1 (DD4.28), УШЯИ.467444.130Э3_4-R1 (XP4.9)
END2P: УШЯИ.467444.130Э3_2-R1 (DD4.22), УШЯИ.467444.130Э3_4-R1 (XP5.9)
ENDU: УШЯИ.467444.130Э3_2-R1 (DD4.9), УШЯИ.467444.130Э3_4-R1 (XP7.37)
ENRGB: УШЯИ.467444.130Э3_2-R1 (DD4.27), УШЯИ.467444.130Э3_4-R1 (XP4.10)
ENRGF: УШЯИ.467444.130Э3_2-R1 (DD4.10), УШЯИ.467444.130Э3_4-R1 (XP7.18)
ENRGI: УШЯИ.467444.130Э3_2-R1 (DD4.11), УШЯИ.467444.130Э3_4-R1 (XP6.8)
ENRGK: УШЯИ.467444.130Э3_2-R1 (DD4.19), УШЯИ.467444.130Э3_5-R1 (XP12.8)
ENRGP: УШЯИ.467444.130Э3_2-R1 (DD4.21), УШЯИ.467444.130Э3_4-R1 (XP5.10)
ENRGV: УШЯИ.467444.130Э3_2-R1 (DD4.20), УШЯИ.467444.130Э3_5-R1 (XP13.8)
ENS: УШЯИ.467444.130Э3_1-R1 (DD1.136), УШЯИ.467444.130Э3_4-R1 (XP7.16)
F_CON1: УШЯИ.467444.130Э3_1-R1 (DD1.104), УШЯИ.467444.130Э3_4-R1 (XP3.26)
F_CON2: УШЯИ.467444.130Э3_1-R1 (DD1.73), УШЯИ.467444.130Э3_2-R1 (DD4.15)
F_CON3: УШЯИ.467444.130Э3_1-R1 (DD1.72), УШЯИ.467444.130Э3_2-R1 (DD4.89)
FIT: УШЯИ.467444.130Э3_4-R1 (XP3.37), УШЯИ.467444.130Э3_5-R1 (XP15.5)
FULL: УШЯИ.467444.130Э3_1-R1 (DD1.133), УШЯИ.467444.130Э3_4-R1 (XP3.36)
IMPB+/-V: УШЯИ.467444.130Э3_1-R1 (DD1.80), УШЯИ.467444.130Э3_4-R1 (XP4.22)
KA: УШЯИ.467444.130Э3_4-R1 (XP3.11), УШЯИ.467444.130Э3_5-R1 (R53.1)
KB: УШЯИ.467444.130Э3_4-R1 (XP3.13), УШЯИ.467444.130Э3_5-R1 (R54.1)
KN_START: УШЯИ.467444.130Э3_4-R1 (XP3.15), УШЯИ.467444.130Э3_5-R1 (R58.2)
KN_STOP: УШЯИ.467444.130Э3_4-R1 (XP3.33), УШЯИ.467444.130Э3_5-R1 (R59.2)
LIMIT: УШЯИ.467444.130Э3_1-R1 (DD1.138), УШЯИ.467444.130Э3_4-R1 (XP4.28 XP5.28 XP7.20), УШЯИ.467444.130Э3_5-R1 (XP10.13)
Meas: УШЯИ.467444.130Э3_2-R1 (DD4.97), УШЯИ.467444.130Э3_5-R1 (XP15.3)
OVLB: УШЯИ.467444.130Э3_4-R1 (XP4.27), УШЯИ.467444.130Э3_5-R1 (R69.1)
OVLBR: УШЯИ.467444.130Э3_1-R1 (DD1.125), УШЯИ.467444.130Э3_5-R1 (R69.2)
OVLI_1: УШЯИ.467444.130Э3_4-R1 (XP6.18), УШЯИ.467444.130Э3_5-R1 (R71.1)
OVLI_1R: УШЯИ.467444.130Э3_1-R1 (DD1.98), УШЯИ.467444.130Э3_5-R1 (R71.2)
OVLI_2R: УШЯИ.467444.130Э3_1-R1 (DD1.99), УШЯИ.467444.130Э3_5-R1 (R73.2)
OVLP: УШЯИ.467444.130Э3_4-R1 (XP5.27), УШЯИ.467444.130Э3_5-R1 (R70.1)
OVLPR: УШЯИ.467444.130Э3_1-R1 (DD1.126), УШЯИ.467444.130Э3_5-R1 (R70.2)
OVLW: УШЯИ.467444.130Э3_4-R1 (XP7.19), УШЯИ.467444.130Э3_5-R1 (R72.1)
OVLWR: УШЯИ.467444.130Э3_1-R1 (DD1.127), УШЯИ.467444.130Э3_5-R1 (R72.2)
RUN_ADC: УШЯИ.467444.130Э3_1-R1 (DD1.74), УШЯИ.467444.130Э3_2-R1 (DA7.4)
RUN_n: УШЯИ.467444.130Э3_2-R1 (DA7.7 R24.1), УШЯИ.467444.130Э3_4-R1 (XP4.12 XP5.12 XP6.9 XP7.35)
RUN_p: УШЯИ.467444.130Э3_2-R1 (DA7.6 R24.2), УШЯИ.467444.130Э3_4-R1 (XP4.13 XP5.13 XP6.10 XP7.36)
RX: УШЯИ.467444.130Э3_2-R1 (DD4.136), УШЯИ.467444.130Э3_4-R1 (XP3.10)
SPI_CLK: УШЯИ.467444.130Э3_1-R1 (DD1.115), УШЯИ.467444.130Э3_4-R1 (XP3.23)
SPI_MISO: УШЯИ.467444.130Э3_1-R1 (DD1.84), УШЯИ.467444.130Э3_4-R1 (XP3.21)
SPICS: УШЯИ.467444.130Э3_1-R1 (DD1.132), УШЯИ.467444.130Э3_4-R1 (XP3.24)
ST_EXT: УШЯИ.467444.130Э3_4-R1 (XP3.32), УШЯИ.467444.130Э3_5-R1 (XP15.1)
ST_TB: УШЯИ.467444.130Э3_1-R1 (DD1.53), УШЯИ.467444.130Э3_2-R1 (DD4.36)
Stop_TB: УШЯИ.467444.130Э3_1-R1 (DD1.137), УШЯИ.467444.130Э3_4-R1 (XP3.22)
TX: УШЯИ.467444.130Э3_2-R1 (DD4.102), УШЯИ.467444.130Э3_4-R1 (XP3.8)
VBUS: УШЯИ.467444.130Э3_2-R1 (DD4.101), УШЯИ.467444.130Э3_4-R1 (R50.1 XP8.2)
WR_RG: УШЯИ.467444.130Э3_1-R1 (DD1.59), УШЯИ.467444.130Э3_2-R1 (DD4.93)